# EAGLE design Octoprober (EAGLE 7.4.0)
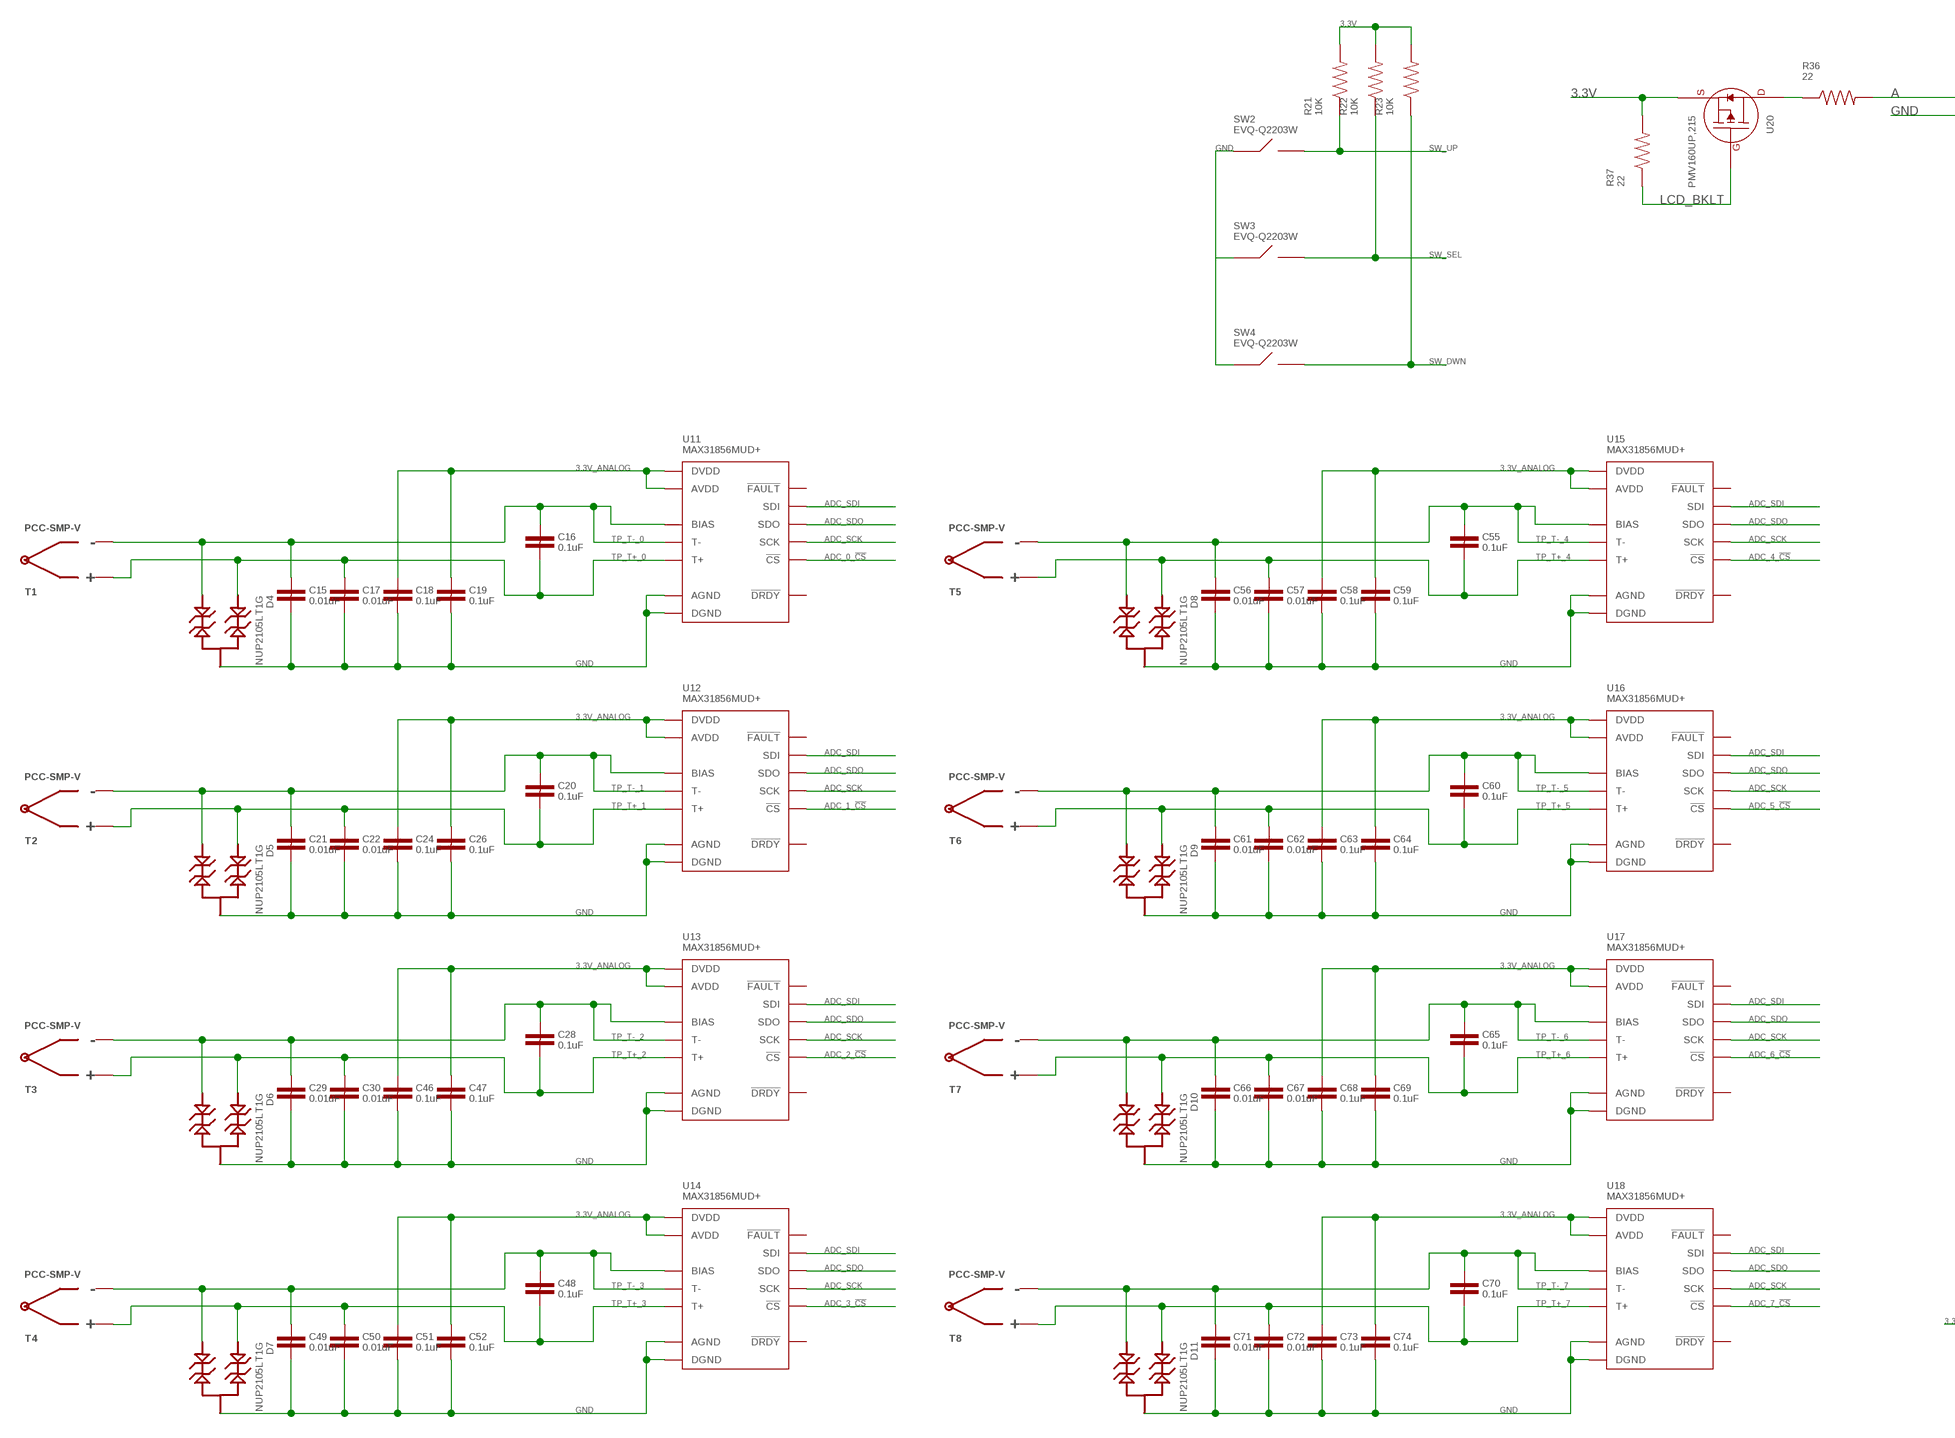
[diagram p0: schematic, sheet 1, part 1 of 3]
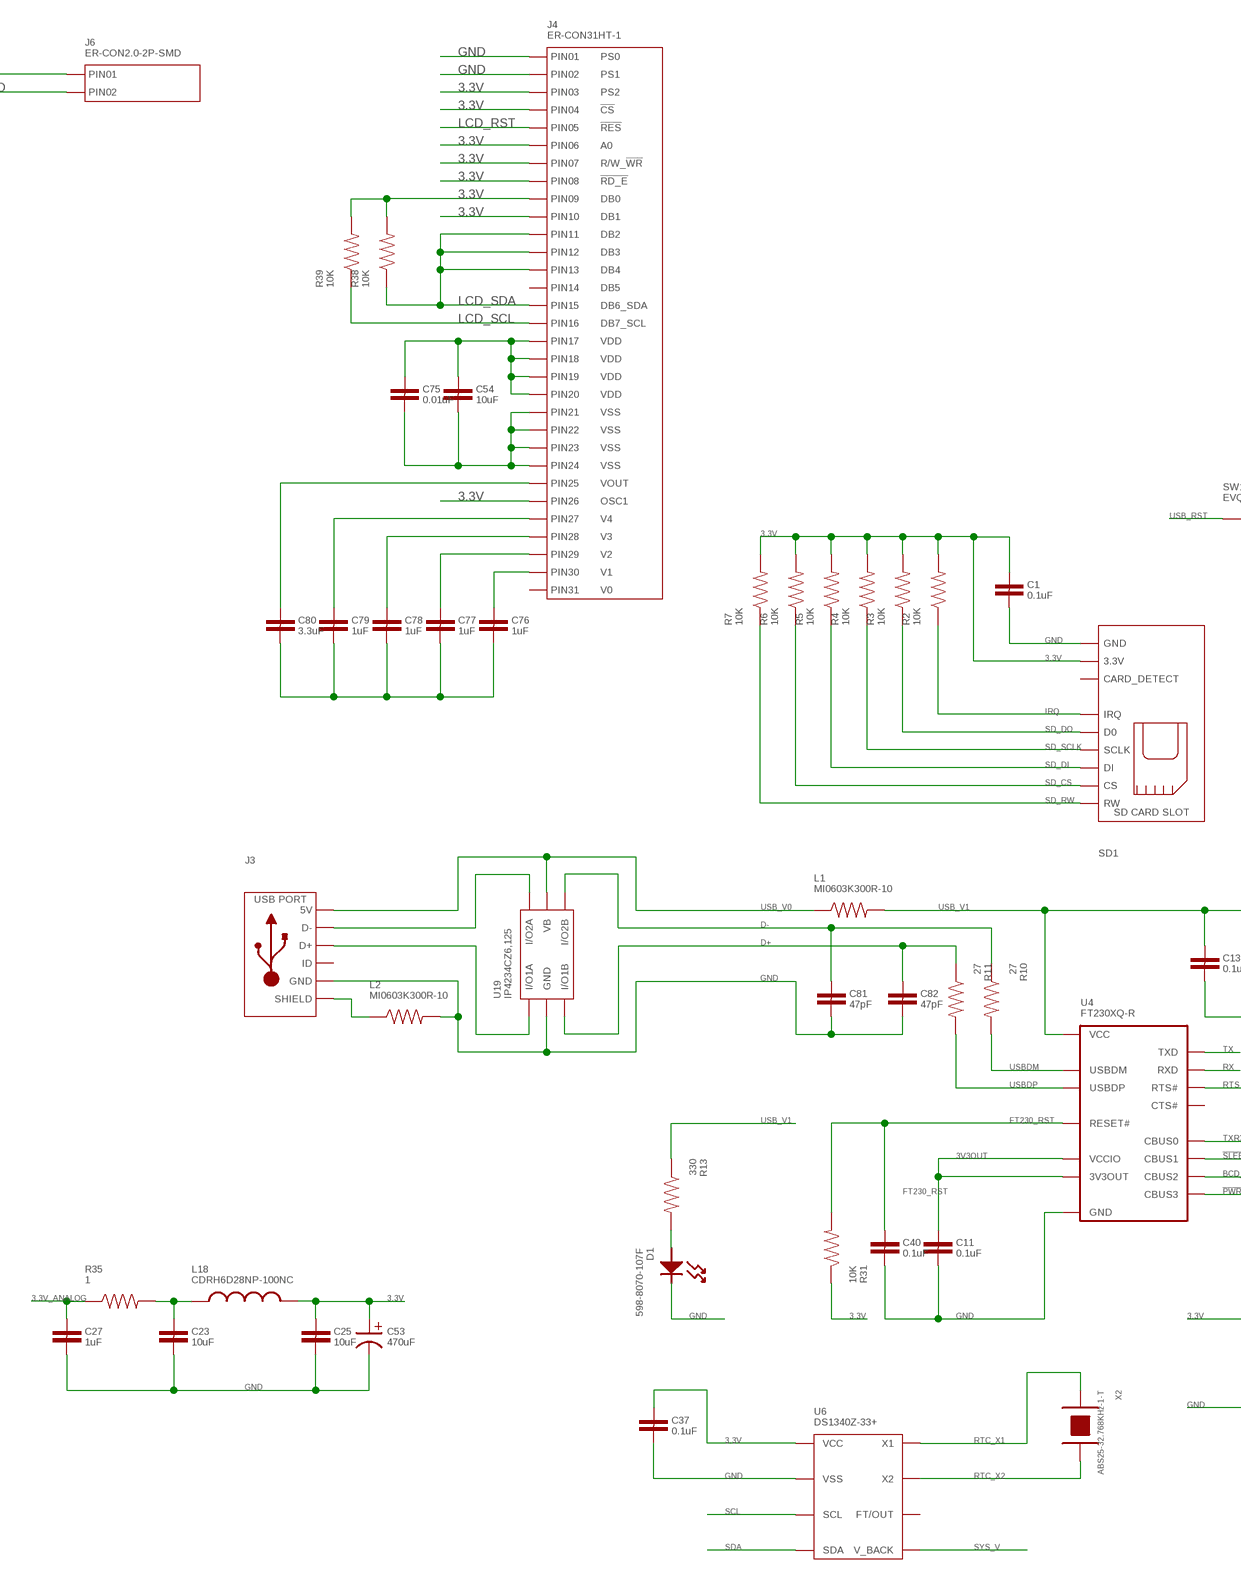
[diagram p1: schematic, sheet 1, part 2 of 3]
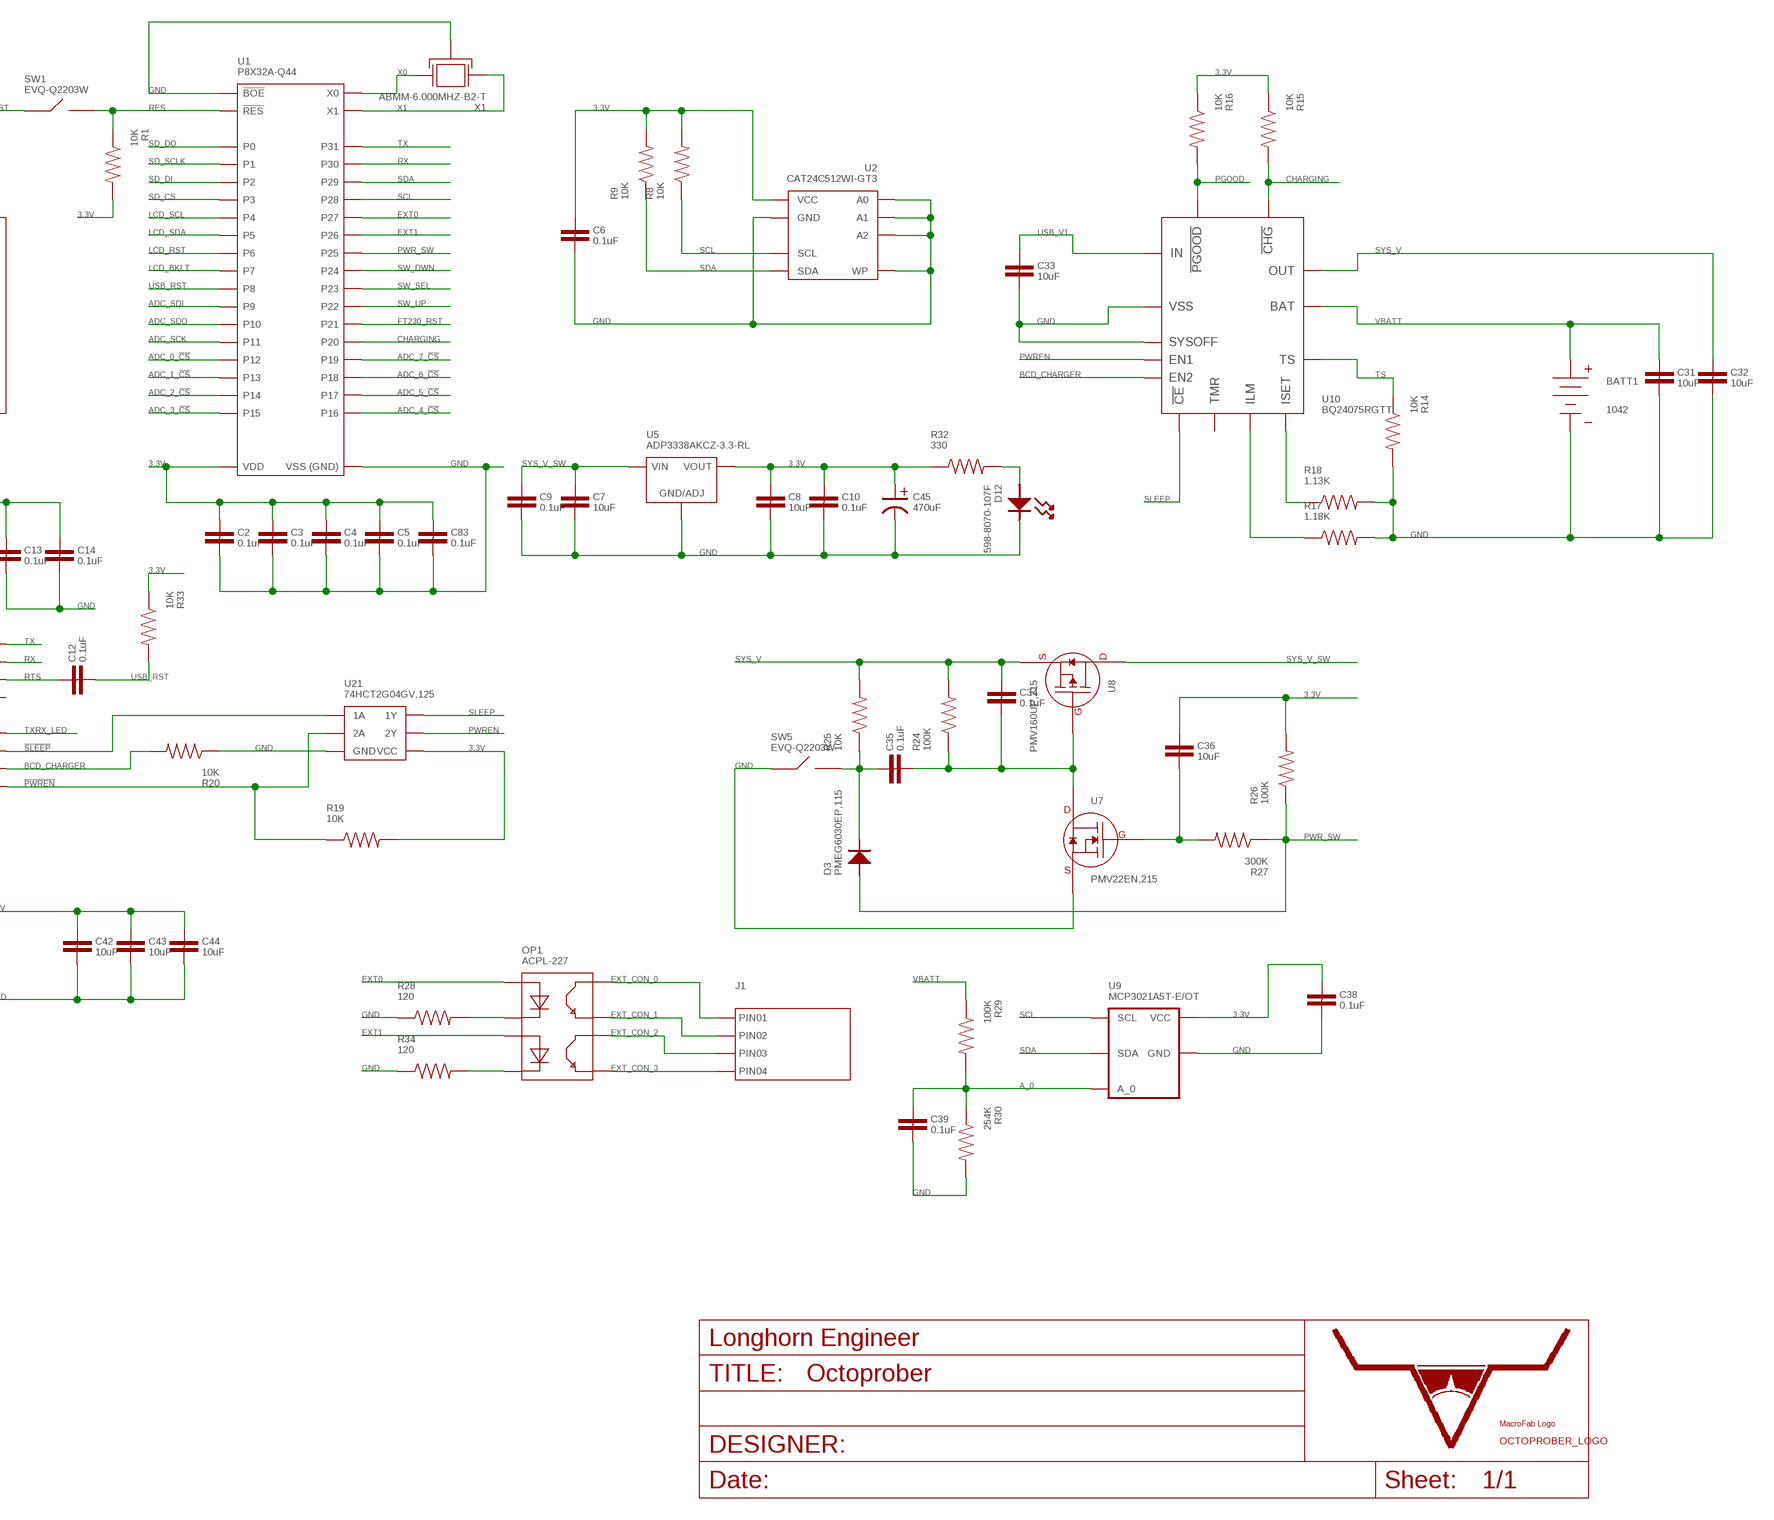
[diagram p2: schematic, sheet 1, part 3 of 3]

## Parts
BATT1  1042  BATTERY_KEYSTON_1042  [KEYSTONE_1042]
C1  0.1uF  CAPACITOR_NON_POLAR_0402  [0402]
C2  0.1uF  CAPACITOR_NON_POLAR_0603  [0603]
C3  0.1uF  CAPACITOR_NON_POLAR_0603  [0603]
C4  0.1uF  CAPACITOR_NON_POLAR_0603  [0603]
C5  0.1uF  CAPACITOR_NON_POLAR_0603  [0603]
C6  0.1uF  CAPACITOR_NON_POLAR_0603  [0603]
C7  10uF  CAPACITOR_NON_POLAR_1206  [1206]
C8  10uF  CAPACITOR_NON_POLAR_1206  [1206]
C9  0.1uF  CAPACITOR_NON_POLAR_0603  [0603]
C10  0.1uF  CAPACITOR_NON_POLAR_0603  [0603]
C11  0.1uF  CAPACITOR_NON_POLAR_0603  [0603]
C12  0.1uF  CAPACITOR_NON_POLAR_0603  [0603]
C13  0.1uF  CAPACITOR_NON_POLAR_0603  [0603]
C14  0.1uF  CAPACITOR_NON_POLAR_0603  [0603]
C15  0.01uF  CAPACITOR_NON_POLAR_0603  [0603]
C16  0.1uF  CAPACITOR_NON_POLAR_0603  [0603]
C17  0.01uF  CAPACITOR_NON_POLAR_0603  [0603]
C18  0.1uF  CAPACITOR_NON_POLAR_0603  [0603]
C19  0.1uF  CAPACITOR_NON_POLAR_0603  [0603]
C20  0.1uF  CAPACITOR_NON_POLAR_0603  [0603]
C21  0.01uF  CAPACITOR_NON_POLAR_0603  [0603]
C22  0.01uF  CAPACITOR_NON_POLAR_0603  [0603]
C23  10uF  CAPACITOR_NON_POLAR_1206  [1206]
C24  0.1uF  CAPACITOR_NON_POLAR_0603  [0603]
C25  10uF  CAPACITOR_NON_POLAR_1206  [1206]
C26  0.1uF  CAPACITOR_NON_POLAR_0603  [0603]
C27  1uF  CAPACITOR_NON_POLAR_0603  [0603]
C28  0.1uF  CAPACITOR_NON_POLAR_0603  [0603]
C29  0.01uF  CAPACITOR_NON_POLAR_0603  [0603]
C30  0.01uF  CAPACITOR_NON_POLAR_0603  [0603]
C31  10uF  CAPACITOR_NON_POLAR_1206  [1206]
C32  10uF  CAPACITOR_NON_POLAR_1206  [1206]
C33  10uF  CAPACITOR_NON_POLAR_1206  [1206]
C34  0.1uF  CAPACITOR_NON_POLAR_0603  [0603]
C35  0.1uF  CAPACITOR_NON_POLAR_0402  [0402]
C36  10uF  CAPACITOR_NON_POLAR_1206  [1206]
C37  0.1uF  CAPACITOR_NON_POLAR_0603  [0603]
C38  0.1uF  CAPACITOR_NON_POLAR_0603  [0603]
C39  0.1uF  CAPACITOR_NON_POLAR_0603  [0603]
C40  0.1uF  CAPACITOR_NON_POLAR_0603  [0603]
C42  10uF  CAPACITOR_NON_POLAR_1206  [1206]
C43  10uF  CAPACITOR_NON_POLAR_1206  [1206]
C44  10uF  CAPACITOR_NON_POLAR_1206  [1206]
C45  470uF  CAPACITOR_POLARIZED_CASE_D  [CASE_D]
C46  0.1uF  CAPACITOR_NON_POLAR_0603  [0603]
C47  0.1uF  CAPACITOR_NON_POLAR_0603  [0603]
C48  0.1uF  CAPACITOR_NON_POLAR_0603  [0603]
C49  0.01uF  CAPACITOR_NON_POLAR_0603  [0603]
C50  0.01uF  CAPACITOR_NON_POLAR_0603  [0603]
C51  0.1uF  CAPACITOR_NON_POLAR_0603  [0603]
C52  0.1uF  CAPACITOR_NON_POLAR_0603  [0603]
C53  470uF  CAPACITOR_POLARIZED_CASE_D  [CASE_D]
C54  10uF  CAPACITOR_NON_POLAR_1206  [1206]
C55  0.1uF  CAPACITOR_NON_POLAR_0603  [0603]
C56  0.01uF  CAPACITOR_NON_POLAR_0603  [0603]
C57  0.01uF  CAPACITOR_NON_POLAR_0603  [0603]
C58  0.1uF  CAPACITOR_NON_POLAR_0603  [0603]
C59  0.1uF  CAPACITOR_NON_POLAR_0603  [0603]
C60  0.1uF  CAPACITOR_NON_POLAR_0603  [0603]
C61  0.01uF  CAPACITOR_NON_POLAR_0603  [0603]
C62  0.01uF  CAPACITOR_NON_POLAR_0603  [0603]
C63  0.1uF  CAPACITOR_NON_POLAR_0603  [0603]
C64  0.1uF  CAPACITOR_NON_POLAR_0603  [0603]
C65  0.1uF  CAPACITOR_NON_POLAR_0603  [0603]
C66  0.01uF  CAPACITOR_NON_POLAR_0603  [0603]
C67  0.01uF  CAPACITOR_NON_POLAR_0603  [0603]
C68  0.1uF  CAPACITOR_NON_POLAR_0603  [0603]
C69  0.1uF  CAPACITOR_NON_POLAR_0603  [0603]
C70  0.1uF  CAPACITOR_NON_POLAR_0603  [0603]
C71  0.01uF  CAPACITOR_NON_POLAR_0603  [0603]
C72  0.01uF  CAPACITOR_NON_POLAR_0603  [0603]
C73  0.1uF  CAPACITOR_NON_POLAR_0603  [0603]
C74  0.1uF  CAPACITOR_NON_POLAR_0603  [0603]
C75  0.01uF  CAPACITOR_NON_POLAR_0603  [0603]
C76  1uF  CAPACITOR_NON_POLAR_0603  [0603]
C77  1uF  CAPACITOR_NON_POLAR_0603  [0603]
C78  1uF  CAPACITOR_NON_POLAR_0603  [0603]
C79  1uF  CAPACITOR_NON_POLAR_0603  [0603]
C80  3.3uF  CAPACITOR_NON_POLAR_0603  [0603]
C81  47pF  CAPACITOR_NON_POLAR_0603  [0603]
C82  47pF  CAPACITOR_NON_POLAR_0603  [0603]
C83  0.1uF  CAPACITOR_NON_POLAR_0603  [0603]
D1  598-8070-107F  LED_SINGLE_0805  [LED_0805]
D3  PMEG6030EP,115  DIODE_SOD-128  [SOD-128]
D4  NUP2105LT1G  TVS_DIODE_DUALSOT-23  [SOT-23]
D5  NUP2105LT1G  TVS_DIODE_DUALSOT-23  [SOT-23]
D6  NUP2105LT1G  TVS_DIODE_DUALSOT-23  [SOT-23]
D7  NUP2105LT1G  TVS_DIODE_DUALSOT-23  [SOT-23]
D8  NUP2105LT1G  TVS_DIODE_DUALSOT-23  [SOT-23]
D9  NUP2105LT1G  TVS_DIODE_DUALSOT-23  [SOT-23]
D10  NUP2105LT1G  TVS_DIODE_DUALSOT-23  [SOT-23]
D11  NUP2105LT1G  TVS_DIODE_DUALSOT-23  [SOT-23]
D12  598-8070-107F  LED_SINGLE_0805  [LED_0805]
J1  CON_01X04_2.54MM_PIN_HEADER  [2.54MM_01X04_PIN_HEADER]
J3  USB_MICRO_RIGHT  [MICROUSB-RIGHT]
J4  ER-CON31HT-1  CON_01X31_ER-CON31HT-1  [ER-CON31HT-1]
J6  ER-CON2.0-2P-SMD  CON_01X02_ER-CON2.0-2P-SMD  [ER-CON2.0-2P-SMD]
L1  MI0603K300R-10  RESISTOR_0603  [0603]
L2  MI0603K300R-10  RESISTOR_0603  [0603]
L18  CDRH6D28NP-100NC  INDUCTOR_CDRH6D28  [CDRH6D28]
OP1  ACPL-227  ACPL-227-500E  [ACPL-227_SO-8]
R1  10K  RESISTOR_0603  [0603]
R2  10K  RESISTOR_0402  [0402]
R3  10K  RESISTOR_0402  [0402]
R4  10K  RESISTOR_0402  [0402]
R5  10K  RESISTOR_0402  [0402]
R6  10K  RESISTOR_0402  [0402]
R7  10K  RESISTOR_0402  [0402]
R8  10K  RESISTOR_0603  [0603]
R9  10K  RESISTOR_0603  [0603]
R10  27  RESISTOR_0603  [0603]
R11  27  RESISTOR_0603  [0603]
R13  330  RESISTOR_0603  [0603]
R14  10K  RESISTOR_0603  [0603]
R15  10K  RESISTOR_0603  [0603]
R16  10K  RESISTOR_0603  [0603]
R17  1.18K  RESISTOR_0603  [0603]
R18  1.13K  RESISTOR_0603  [0603]
R19  10K  RESISTOR_0603  [0603]
R20  10K  RESISTOR_0603  [0603]
R21  10K  RESISTOR_0603  [0603]
R22  10K  RESISTOR_0603  [0603]
R23  10K  RESISTOR_0603  [0603]
R24  100K  RESISTOR_0603  [0603]
R25  10K  RESISTOR_0603  [0603]
R26  100K  RESISTOR_0603  [0603]
R27  300K  RESISTOR_0603  [0603]
R28  120  RESISTOR_0603  [0603]
R29  100K  RESISTOR_0603  [0603]
R30  254K  RESISTOR_0603  [0603]
R31  10K  RESISTOR_0603  [0603]
R32  330  RESISTOR_0603  [0603]
R33  10K  RESISTOR_0603  [0603]
R34  120  RESISTOR_0603  [0603]
R35  1  RESISTOR_0603  [0603]
R36  22  RESISTOR_0603  [0603]
R37  22  RESISTOR_0603  [0603]
R38  10K  RESISTOR_0603  [0603]
R39  10K  RESISTOR_0603  [0603]
SD1  SD_CARD_SLOT_MICRO_RIGHT  [MICROSDSLOT-RIGHT]
SW1  EVQ-Q2203W  SPST_EVQ-Q2203W  [EVQ-Q2203W]
SW2  EVQ-Q2203W  SPST_EVQ-Q2203W  [EVQ-Q2203W]
SW3  EVQ-Q2203W  SPST_EVQ-Q2203W  [EVQ-Q2203W]
SW4  EVQ-Q2203W  SPST_EVQ-Q2203W  [EVQ-Q2203W]
SW5  EVQ-Q2203W  SPST_EVQ-Q2203W  [EVQ-Q2203W]
T1  PCC-SMP-V  THERMOCOUPLE_CON_PCC-SMP-V  [PCC-SMP-V]
T2  PCC-SMP-V  THERMOCOUPLE_CON_PCC-SMP-V  [PCC-SMP-V]
T3  PCC-SMP-V  THERMOCOUPLE_CON_PCC-SMP-V  [PCC-SMP-V]
T4  PCC-SMP-V  THERMOCOUPLE_CON_PCC-SMP-V  [PCC-SMP-V]
T5  PCC-SMP-V  THERMOCOUPLE_CON_PCC-SMP-V  [PCC-SMP-V]
T6  PCC-SMP-V  THERMOCOUPLE_CON_PCC-SMP-V  [PCC-SMP-V]
T7  PCC-SMP-V  THERMOCOUPLE_CON_PCC-SMP-V  [PCC-SMP-V]
T8  PCC-SMP-V  THERMOCOUPLE_CON_PCC-SMP-V  [PCC-SMP-V]
U1  P8X32A-Q44  [LQFP44]
U2  CAT24C512WI-GT3  EEPROM_I2CSOIC-8  [SOIC-8]
U4  FT230XQ-R  FT230XQ  [FT230X_QFN-16]
U5  ADP3338AKCZ-3.3-RL  LINEAR_VOTLAGE_REGULATORS_ADP3338  [ADP3338_SOT-223-3]
U6  DS1340Z-33+  [DS1340Z_SOIC-8]
U7  PMV22EN,215  MOSFET_N-CHANNEL_SINGLE_SOT-23  [SOT-23-3]
U8  PMV160UP,215  MOSFET_P-CHANNEL_SINGLE_SOT-23  [SOT-23-3]
U9  MCP3021A5T-E/OT  MCP3021A0T-E/OT  [MCP3021_SOT-23-5]
U10  BQ24075RGTT  BQ2407(5/9)  [BQ2407X_VQFN-16]
U11  MAX31856MUD+  [MAX31856_TTSOP-14]
U12  MAX31856MUD+  [MAX31856_TTSOP-14]
U13  MAX31856MUD+  [MAX31856_TTSOP-14]
U14  MAX31856MUD+  [MAX31856_TTSOP-14]
U15  MAX31856MUD+  [MAX31856_TTSOP-14]
U16  MAX31856MUD+  [MAX31856_TTSOP-14]
U17  MAX31856MUD+  [MAX31856_TTSOP-14]
U18  MAX31856MUD+  [MAX31856_TTSOP-14]
U19  IP4234CZ6,125  IP4234CZ6  [IP4234CZ6_SOT-457-6]
U20  PMV160UP,215  MOSFET_P-CHANNEL_SINGLE_SOT-23  [SOT-23-3]
U21  74HCT2G04GV,125  [74HCT2G04_TTSOP-6]
U$1  LHE_FRAME  [LHE_FRAME]
U$2  OCTOPROBER_LOGONORMAL  [OCTOPROBER_LOGO]
U$7  MF_LOGOLOGO_MEDIUM  [MF_LOGO_MEDIUM]
X1  ABMM-6.000MHZ-B2-T  XTL_7MMX5MM  [7MMX5MM]
X2  ABS25-32.768KHz-1-T  CRYSTAL_8MM_X_3.8MM  [8MM_X_3.8MM]

## Nets
3.3V: C1.1 C2.1 C3.1 C4.1 C5.1 C6.1 C8.1 C10.1 C25.1 C36.1 C37.1 C38.1 C42.1 C43.1 C44.1 C45.P(POS) C53.P(POS) C83.1 J4.P$3(PIN3) J4.P$4(PIN4) J4.P$6(PIN6) J4.P$7(PIN7) J4.P$8(PIN8) J4.P$9(PIN9) J4.P$10(PIN10) J4.P$26(PIN26) L18.P$2 R1.2 R2.2 R3.2 R4.2 R5.2 R6.2 R7.2 R8.2 R9.2 R15.1 R16.1 R19.2 R21.2 R22.2 R23.2 R26.2 R31.1 R32.1 R33.1 R37.2 R38.2 R39.2 SD1.PIN4(3.3V) U1.8(VDD) U1.18(VDD) U1.30(VDD) U1.40(VDD) U2.8(VCC) U5.2(OUT) U5.PAD(OUT) U6.8(VCC) U9.1(VCC) U20.2(SOURCE) U21.5(VCC)
3.3V_ANALOG: C18.1 C19.1 C24.1 C26.1 C27.1 C46.1 C47.1 C51.1 C52.1 C58.1 C59.1 C63.1 C64.1 C68.1 C69.1 C73.1 C74.1 R35.1 U11.P$5(AVDD) U11.P$8(DVDD) U12.P$5(AVDD) U12.P$8(DVDD) U13.P$5(AVDD) U13.P$8(DVDD) U14.P$5(AVDD) U14.P$8(DVDD) U15.P$5(AVDD) U15.P$8(DVDD) U16.P$5(AVDD) U16.P$8(DVDD) U17.P$5(AVDD) U17.P$8(DVDD) U18.P$5(AVDD) U18.P$8(DVDD)
3V3OUT: C11.1 U4.1(VCCIO) U4.8(3V3OUT)
!PWREN: R19.1 U4.14(CBUS3) U21.3(2A)
!SLEEP: U4.11(CBUS1) U21.1(1A)
A: J6.P$1(PIN1) R36.2
A_0: C39.1 R29.2 R30.1 U9.3(A_0)
ADC_0_!CS: U1.13(P12) U11.P$9(!CS)
ADC_1_!CS: U1.14(P13) U12.P$9(!CS)
ADC_2_!CS: U1.15(P14) U13.P$9(!CS)
ADC_3_!CS: U1.16(P15) U14.P$9(!CS)
ADC_4_!CS: U1.19(P16) U15.P$9(!CS)
ADC_5_!CS: U1.20(P17) U16.P$9(!CS)
ADC_6_!CS: U1.21(P18) U17.P$9(!CS)
ADC_7_!CS: U1.22(P19) U18.P$9(!CS)
ADC_SCK: U1.12(P11) U11.P$10(SCK) U12.P$10(SCK) U13.P$10(SCK) U14.P$10(SCK) U15.P$10(SCK) U16.P$10(SCK) U17.P$10(SCK) U18.P$10(SCK)
ADC_SDI: U1.10(P9) U11.P$12(SDI) U12.P$12(SDI) U13.P$12(SDI) U14.P$12(SDI) U15.P$12(SDI) U16.P$12(SDI) U17.P$12(SDI) U18.P$12(SDI)
ADC_SDO: U1.11(P10) U11.P$11(SDO) U12.P$11(SDO) U13.P$11(SDO) U14.P$11(SDO) U15.P$11(SDO) U16.P$11(SDO) U17.P$11(SDO) U18.P$11(SDO)
BCD_CHARGER: R20.2 U4.5(CBUS2) U10.5(EN2)
CHARGING: R15.2 U1.23(P20) U10.9(!CHG)
D+: C82.1 R11.1 U19.3(I/O1B)
D-: C81.1 R10.1 U19.4(I/O2B)
EXT0: OP1.1 U1.34(P27)
EXT1: OP1.3 U1.33(P26)
EXT_CON_0: J1.1 OP1.8
EXT_CON_1: J1.2 OP1.7
EXT_CON_2: J1.3 OP1.6
EXT_CON_3: J1.4 OP1.5
FT230_RST: C40.1 R31.2 U1.24(P21) U4.9(RESET#)
GND: BATT1.N(-) C1.2 C2.2 C3.2 C4.2 C5.2 C6.2 C7.2 C8.2 C9.2 C10.2 C11.2 C13.2 C14.2 C15.2 C17.2 C18.2 C19.2 C21.2 C22.2 C23.2 C24.2 C25.2 C26.2 C27.2 C29.2 C30.2 C31.2 C32.2 C33.2 C37.2 C38.2 C39.2 C40.2 C42.2 C43.2 C44.2 C45.N(NEG) C46.2 C47.2 C49.2 C50.2 C51.2 C52.2 C53.N(NEG) C56.2 C57.2 C58.2 C59.2 C61.2 C62.2 C63.2 C64.2 C66.2 C67.2 C68.2 C69.2 C71.2 C72.2 C73.2 C74.2 C81.2 C82.2 C83.2 D1.CATHODE D4.3 D5.3 D6.3 D7.3 D8.3 D9.3 D10.3 D11.3 D12.CATHODE J3.5(GND) J4.P$1(PIN1) J4.P$2(PIN2) J6.P$2(PIN2) L2.2 R14.2 R17.2 R18.2 R20.1 R28.1 R30.2 R34.1 SD1.G0(GND) SD1.G1(GND) SD1.PIN6(GND) SW2.1(A) SW2.2(A) SW3.1(A) SW3.2(A) SW4.1(A) SW4.2(A) SW5.1(A) SW5.2(A) U1.5(VSS) U1.6(BOE') U1.17(VSS) U1.27(VSS) U1.39(VSS) U2.1(A0) U2.2(A1) U2.3(A2) U2.4(GND) U2.7(WP) U4.3(GND) U4.13(GND) U4.PAD(GND) U5.1(GND) U6.4(VSS) U7.2(SOURCE) U9.2(GND) U10.8(VSS) U10.15(SYSOFF) U10.PAD0(VSS) U10.PAD1(VSS) U11.P$1(AGND) U11.P$14(DGND) U12.P$1(AGND) U12.P$14(DGND) U13.P$1(AGND) U13.P$14(DGND) U14.P$1(AGND) U14.P$14(DGND) U15.P$1(AGND) U15.P$14(DGND) U16.P$1(AGND) U16.P$14(DGND) U17.P$1(AGND) U17.P$14(DGND) U18.P$1(AGND) U18.P$14(DGND) U19.2(GND) U21.2(GND) X1.P$2(GND) X1.P$4(GND)
ILM: R17.1 U10.12(ILM)
IRQ: R2.1 SD1.PIN8(IRQ)
ISET: R18.1 U10.16(ISET)
LCD_BKLT: R37.1 U1.4(P7) U20.1(GATE)
LCD_RST: J4.P$5(PIN5) U1.3(P6)
LCD_SCL: J4.P$16(PIN16) R39.1 U1.1(P4)
LCD_SDA: J4.P$11(PIN11) J4.P$12(PIN12) J4.P$13(PIN13) J4.P$15(PIN15) R38.1 U1.2(P5)
N$2: C54.1 C75.1 J4.P$17(PIN17) J4.P$18(PIN18) J4.P$19(PIN19) J4.P$20(PIN20)
N$3: D1.ANODE R13.2
N$4: C35.1 D3.CATHODE R25.1 SW5.3(B) SW5.4(B)
N$5: C36.2 R27.2 U7.1(GATE)
N$6: OP1.2 R28.2
N$7: R36.1 U20.3(DRAIN)
N$8: C54.2 C75.2 J4.P$21(PIN21) J4.P$22(PIN22) J4.P$23(PIN23) J4.P$24(PIN24)
N$9: C80.1 J4.P$25(PIN25)
N$10: C79.1 J4.P$27(PIN27)
N$11: C78.1 J4.P$28(PIN28)
N$12: C77.1 J4.P$29(PIN29)
N$13: C76.1 J4.P$30(PIN30)
N$14: C76.2 C77.2 C78.2 C79.2 C80.2
N$22: D12.ANODE R32.2
N$23: J3.2(D-) U19.6(I/O2A)
N$24: OP1.4 R34.2
N$25: C23.1 L18.P$1 R35.2
N$26: J3.3(D+) U19.1(I/O1A)
N$27: J3.S1(SLD) J3.S2(SLD) J3.S3(SLD) J3.S4(SLD) J3.S5(SLD) J3.S6(SLD) L2.1
PGOOD: R16.2 U10.7(!PGOOD)
PWR_SW: D3.ANODE R26.1 R27.1 U1.32(P25)
PWREN: U10.6(EN1) U21.4(2Y)
RES: R1.1 SW1.3(B) SW1.4(B) U1.7(RES')
RTC_X1: U6.1(X1) X2.1
RTC_X2: U6.2(X2) X2.4
RTS: C12.1 U4.16(RTS#)
RX: U1.37(P30) U4.2(RXD)
S_P_G: C34.2 C35.2 R24.1 U7.3(DRAIN) U8.1(GATE)
SCL: R8.1 U1.35(P28) U2.6(SCL) U6.6(SCL) U9.5(SCL)
SD_CS: R6.1 SD1.PIN2(CS) U1.44(P3)
SD_DI: R5.1 SD1.PIN3(DI) U1.43(P2)
SD_DO: R3.1 SD1.PIN7(D0) U1.41(P0)
SD_RW: R7.1 SD1.PIN1(RW)
SD_SCLK: R4.1 SD1.PIN5(SCLK) U1.42(P1)
SDA: R9.1 U1.36(P29) U2.5(SDA) U6.5(SDA) U9.4(SDA)
SLEEP: U10.4(!CE) U21.6(1Y)
SW_DWN: R23.1 SW4.3(B) SW4.4(B) U1.31(P24)
SW_SEL: R22.1 SW3.3(B) SW3.4(B) U1.26(P23)
SW_UP: R21.1 SW2.3(B) SW2.4(B) U1.25(P22)
SYS_V: C32.1 C34.1 R24.2 R25.2 U6.3(V_BACK) U8.2(SOURCE) U10.10(OUT) U10.11(OUT)
SYS_V_SW: C7.1 C9.1 U5.3(IN) U8.3(DRAIN)
TP_T+_0: C16.2 C17.1 D4.1 T1.POS U11.P$4(T+)
TP_T+_1: C20.2 C22.1 D5.1 T2.POS U12.P$4(T+)
TP_T+_2: C28.2 C30.1 D6.1 T3.POS U13.P$4(T+)
TP_T+_3: C48.2 C50.1 D7.1 T4.POS U14.P$4(T+)
TP_T+_4: C55.2 C57.1 D8.1 T5.POS U15.P$4(T+)
TP_T+_5: C60.2 C62.1 D9.1 T6.POS U16.P$4(T+)
TP_T+_6: C65.2 C67.1 D10.1 T7.POS U17.P$4(T+)
TP_T+_7: C70.2 C72.1 D11.1 T8.POS U18.P$4(T+)
TP_T-_0: C15.1 C16.1 D4.2 T1.NEG U11.P$2(BIAS) U11.P$3(T-)
TP_T-_1: C20.1 C21.1 D5.2 T2.NEG U12.P$2(BIAS) U12.P$3(T-)
TP_T-_2: C28.1 C29.1 D6.2 T3.NEG U13.P$2(BIAS) U13.P$3(T-)
TP_T-_3: C48.1 C49.1 D7.2 T4.NEG U14.P$2(BIAS) U14.P$3(T-)
TP_T-_4: C55.1 C56.1 D8.2 T5.NEG U15.P$2(BIAS) U15.P$3(T-)
TP_T-_5: C60.1 C61.1 D9.2 T6.NEG U16.P$2(BIAS) U16.P$3(T-)
TP_T-_6: C65.1 C66.1 D10.2 T7.NEG U17.P$2(BIAS) U17.P$3(T-)
TP_T-_7: C70.1 C71.1 D11.2 T8.NEG U18.P$2(BIAS) U18.P$3(T-)
TS: R14.1 U10.1(TS)
TX: U1.38(P31) U4.15(TXD)
TXRX_LED: U4.12(CBUS0)
USB_RST: C12.2 R33.2 SW1.1(A) SW1.2(A) U1.9(P8)
USB_V0: J3.1(5V) L1.1 U19.5(VB)
USB_V1: C13.1 C14.1 C33.1 L1.2 R13.1 U4.10(VCC) U10.13(IN)
USBDM: R10.2 U4.7(USBDM)
USBDP: R11.2 U4.6(USBDP)
VBATT: BATT1.P(+) C31.1 R29.1 U10.2(BAT) U10.3(BAT)
X0: U1.29(X0) X1.P$3(X1)
X1: U1.28(X1) X1.P$1(X0)
Unconnected: J3.4(ID) J4.P$14(PIN14) J4.P$31(PIN31) SD1.PIN9(CRD_DTCT) SD1.PIN10(CRD_DTCT) U4.4(CTS#) U6.7(FT/OUT) U10.14(TMR) U11.P$7(!DRDY) U11.P$13(!FAULT) U12.P$7(!DRDY) U12.P$13(!FAULT) U13.P$7(!DRDY) U13.P$13(!FAULT) U14.P$7(!DRDY) U14.P$13(!FAULT) U15.P$7(!DRDY) U15.P$13(!FAULT) U16.P$7(!DRDY) U16.P$13(!FAULT) U17.P$7(!DRDY) U17.P$13(!FAULT) U18.P$7(!DRDY) U18.P$13(!FAULT)

## Library data of the parts
BATT1 = PP_Connectors:BATTERY
C1-C40 C42-C44 C46-C52 C54-C83 = PP_Passives:CAPACITOR_NON_POLAR: Capacitor Non Polarized
C45 C53 = PP_Passives:CAPACITOR_POLARIZED: Polarized capacitors
D1 D12 = PP_LED:LED_SINGLE
D3 = PP_Passives:DIODE: Diode - Single
D4-D11 = PP_Passives:TVS_DIODE_DUAL
J1 = PP_Connectors:CON_01X04: 4 Pin Connectors
J3 = MF_Connectors:USB: Library: MF_Connectors Description: 5 Pin USB Connectors. SLD is the shield connection. Usually tied to ground through a small ferrite bead.
J4 = PP_Connectors:CON_01X31; LABEL01: PS0; LABEL02: PS1; LABEL03: PS2; LABEL04: !CS; LABEL05: !RES; LABEL06: A0; LABEL07: R/W_!WR; LABEL08: !RD_E; LABEL09: DB0; LABEL10: DB1; LABEL11: DB2; LABEL12: DB3; LABEL13: DB4; LABEL14: DB5; LABEL15: DB6_SDA; LABEL16: DB7_SCL; LABEL17: VDD; LABEL18: VDD; LABEL19: VDD; LABEL20: VDD; LABEL21: VSS; LABEL22: VSS; LABEL23: VSS; LABEL24: VSS; LABEL25: VOUT; LABEL26: OSC1; LABEL27: V4; LABEL28: V3; LABEL29: V2; LABEL30: V1; LABEL31: V0
J6 = PP_Connectors:CON_01X02
L1 L2 R1-R11 R13-R39 = PP_Passives:RESISTOR: Resistors
L18 = PP_Passives:INDUCTOR: Inductors
OP1 = PP_DigitalIC:ACPL-227: Manufacturer Part #: ACPL-227 Manufacturer: Avago Technologies Description: Transistor Output Optocouplers DC Phototx Coupler
SD1 = MF_Connectors:SD_CARD_SLOT: Library: MF_Connectors Description: SD Card Connector
SW1-SW5 = PP_Electromechanical:SPST: SPST Switches
T1-T8 = PP_Connectors:THERMOCOUPLE_CON
U1 = MF_IC_Digital:P8X32A: Manufacturer Part #: P8X32A Manufacturer: Parallax Description: 32-bit Microcontrollers - MCU LQFP pkg Propeller Chip
U2 = PP_DigitalIC:EEPROM_I2C
U4 = PP_DigitalIC:FT230X: Manufacturer Part #: FT230X Manufacturer: FTDI Description: USB Interface IC USB to Basic Serial UART IC
U5 = PP_PowerIC:LINEAR_VOTLAGE_REGULATORS
U6 = PP_DigitalIC:DS1340Z: Manufacturer Part #: DS1340Z Manufacturer: Maxim Integrated Description: Real Time Clock I2C RTC w/Trickle Charger
U7 = PP_DiscreteSemi:MOSFET_N-CHANNEL_SINGLE: Mosfet - N-Channel - Single
U8 U20 = PP_DiscreteSemi:MOSFET_P-CHANNEL_SINGLE
U9 = PP_DigitalIC:MCP3021: Manufacturer Part #: MCP3021 Manufacturer: Microchip Technology Description: Analog to Digital Converters - ADC 10-bit ADC I2C Single Channel
U10 = PP_PowerIC:BQ2407(5/9): Manufacturer Part #: BQ24075 / BQ24079 Manufacturer: Texas Instruments Description: Battery Management Li-Ion Batt Chrgr & Pwr-Path Mgmt IC
U11-U18 = PP_AnalogIC:MAX31856: Manufacturer Part #: MAX31856 Manufacturer: Maxim Integrated Description: Sensor Interface Precision Thermocouple to Digital Converter with Linearization
U19 = PP_Passives:IP4234CZ6: Mouser Part #: 771-IP4234CZ6125 Manufacturer Part #: IP4234CZ6,125 Manufacturer: NXP Semiconductors Description: ESD Suppressors Single USB 2.0 ESD Protection 6-Pin http://www.mouser.com/ProductDetail/NXP-Semiconductors/IP4234CZ6125/?qs=sGAEpiMZZMvxHShE6Whpu7QUdHOfUl1T0xbl582qhFk%3d
U21 = PP_DigitalIC:74HCT2G04: Manufacturer Part #: 74HCT2G04 Manufacturer: NXP Semiconductors Description: Inverters 5V 2-INPUT SINGLE
U$1 = PP_Aesthetics:LHE_FRAME; DNAME: Parker Dillmann; REVNUM: REV 3
U$2 = PP_Aesthetics:OCTOPROBER_LOGO
U$7 = PP_Aesthetics:MF_LOGO
X1 = MF_Frequency_Control:XTL: Library: MF_Frequency_Control Description: Device for Cyrstal Oscillators. Manufacture part number (MFG#) can be added via Attributes.
X2 = PP_FreqCtrl:CRYSTAL

## Board
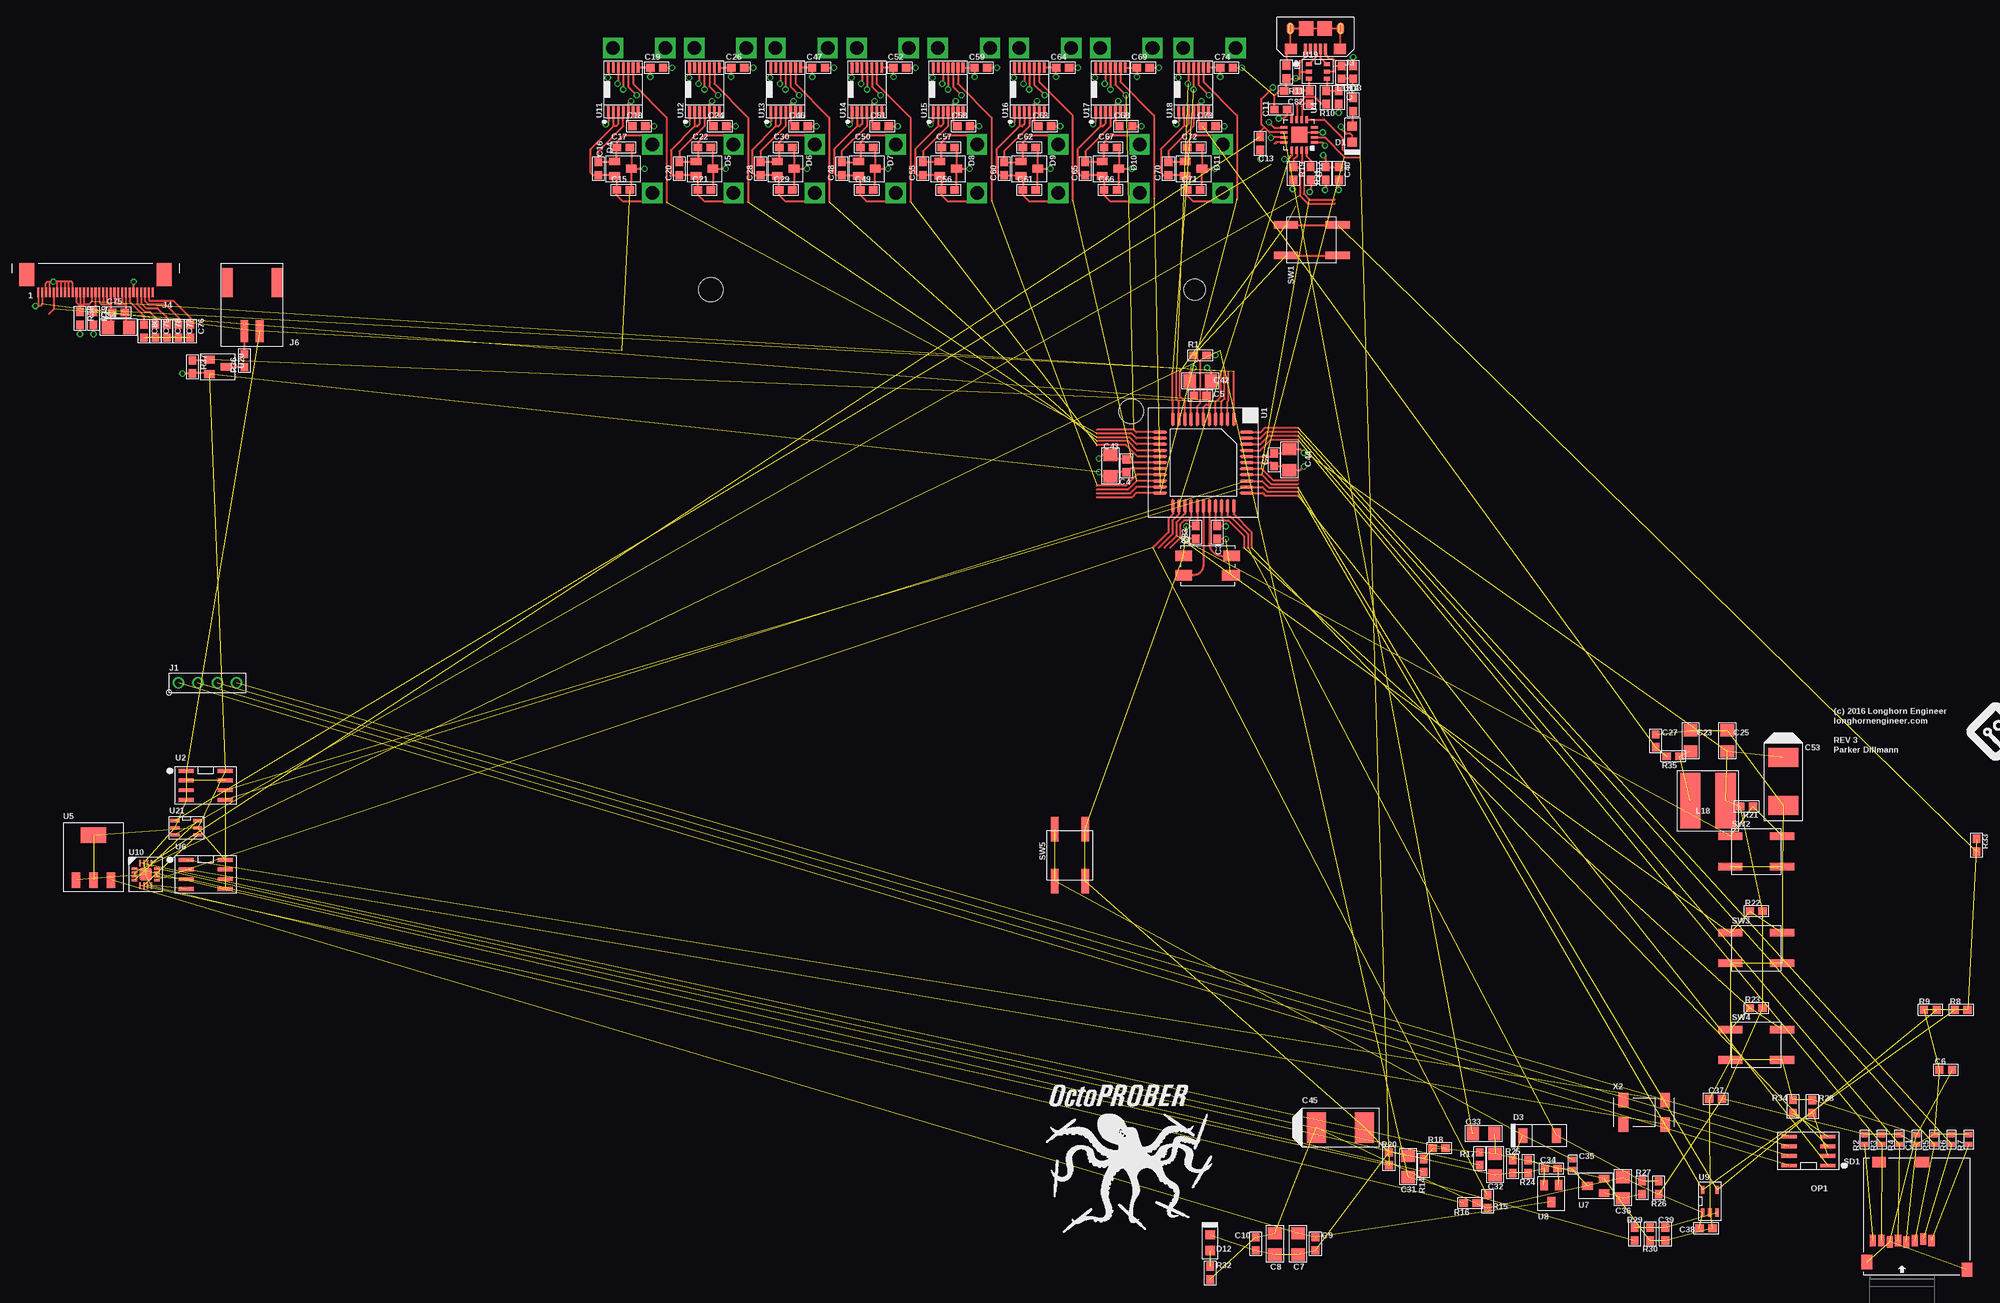
[diagram p3: board, top side]
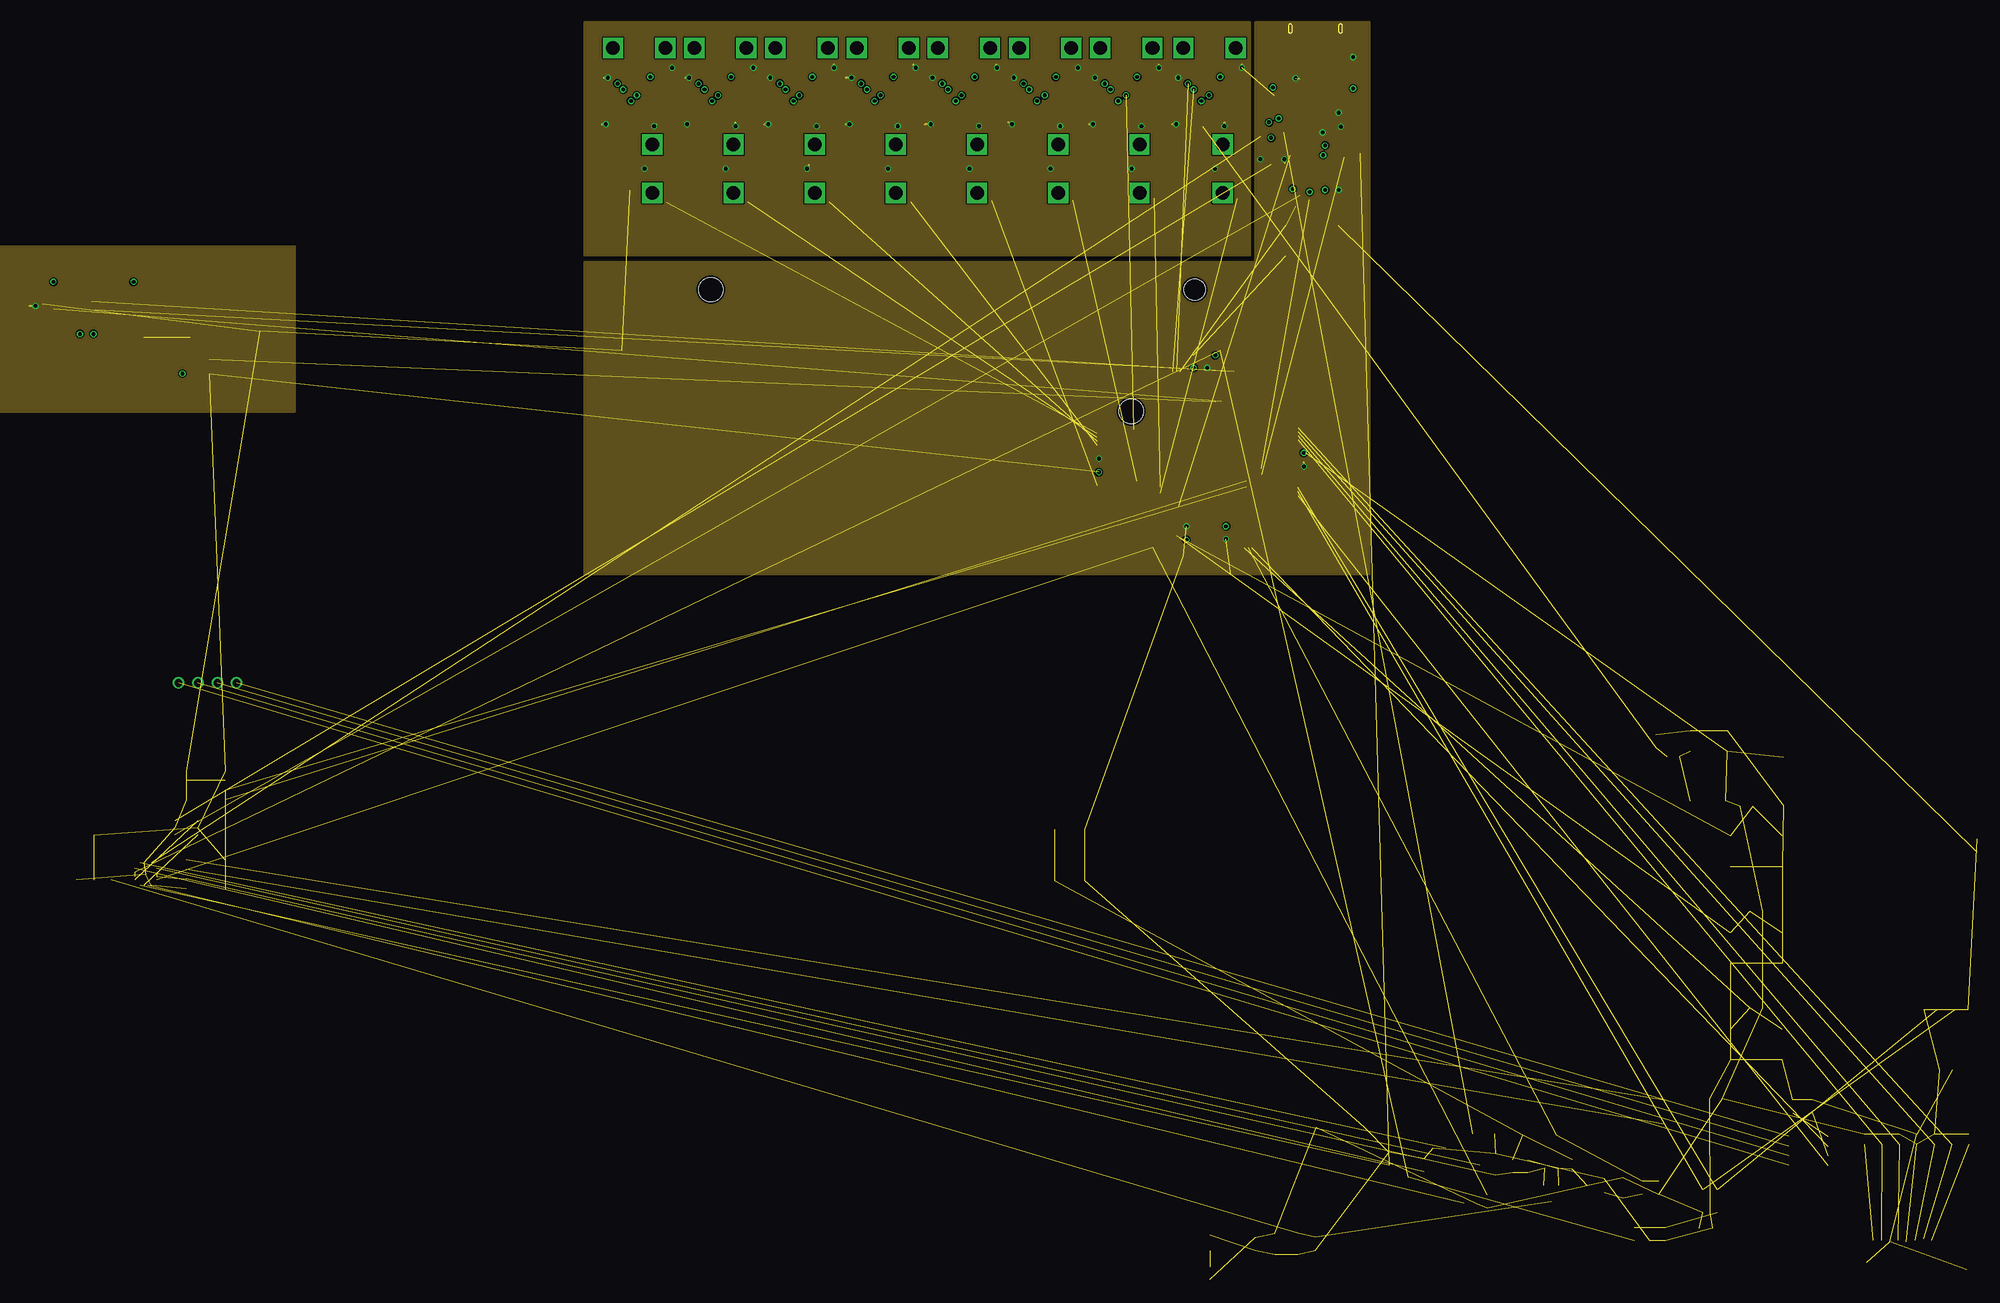
[diagram p4: board, inner layer GND]
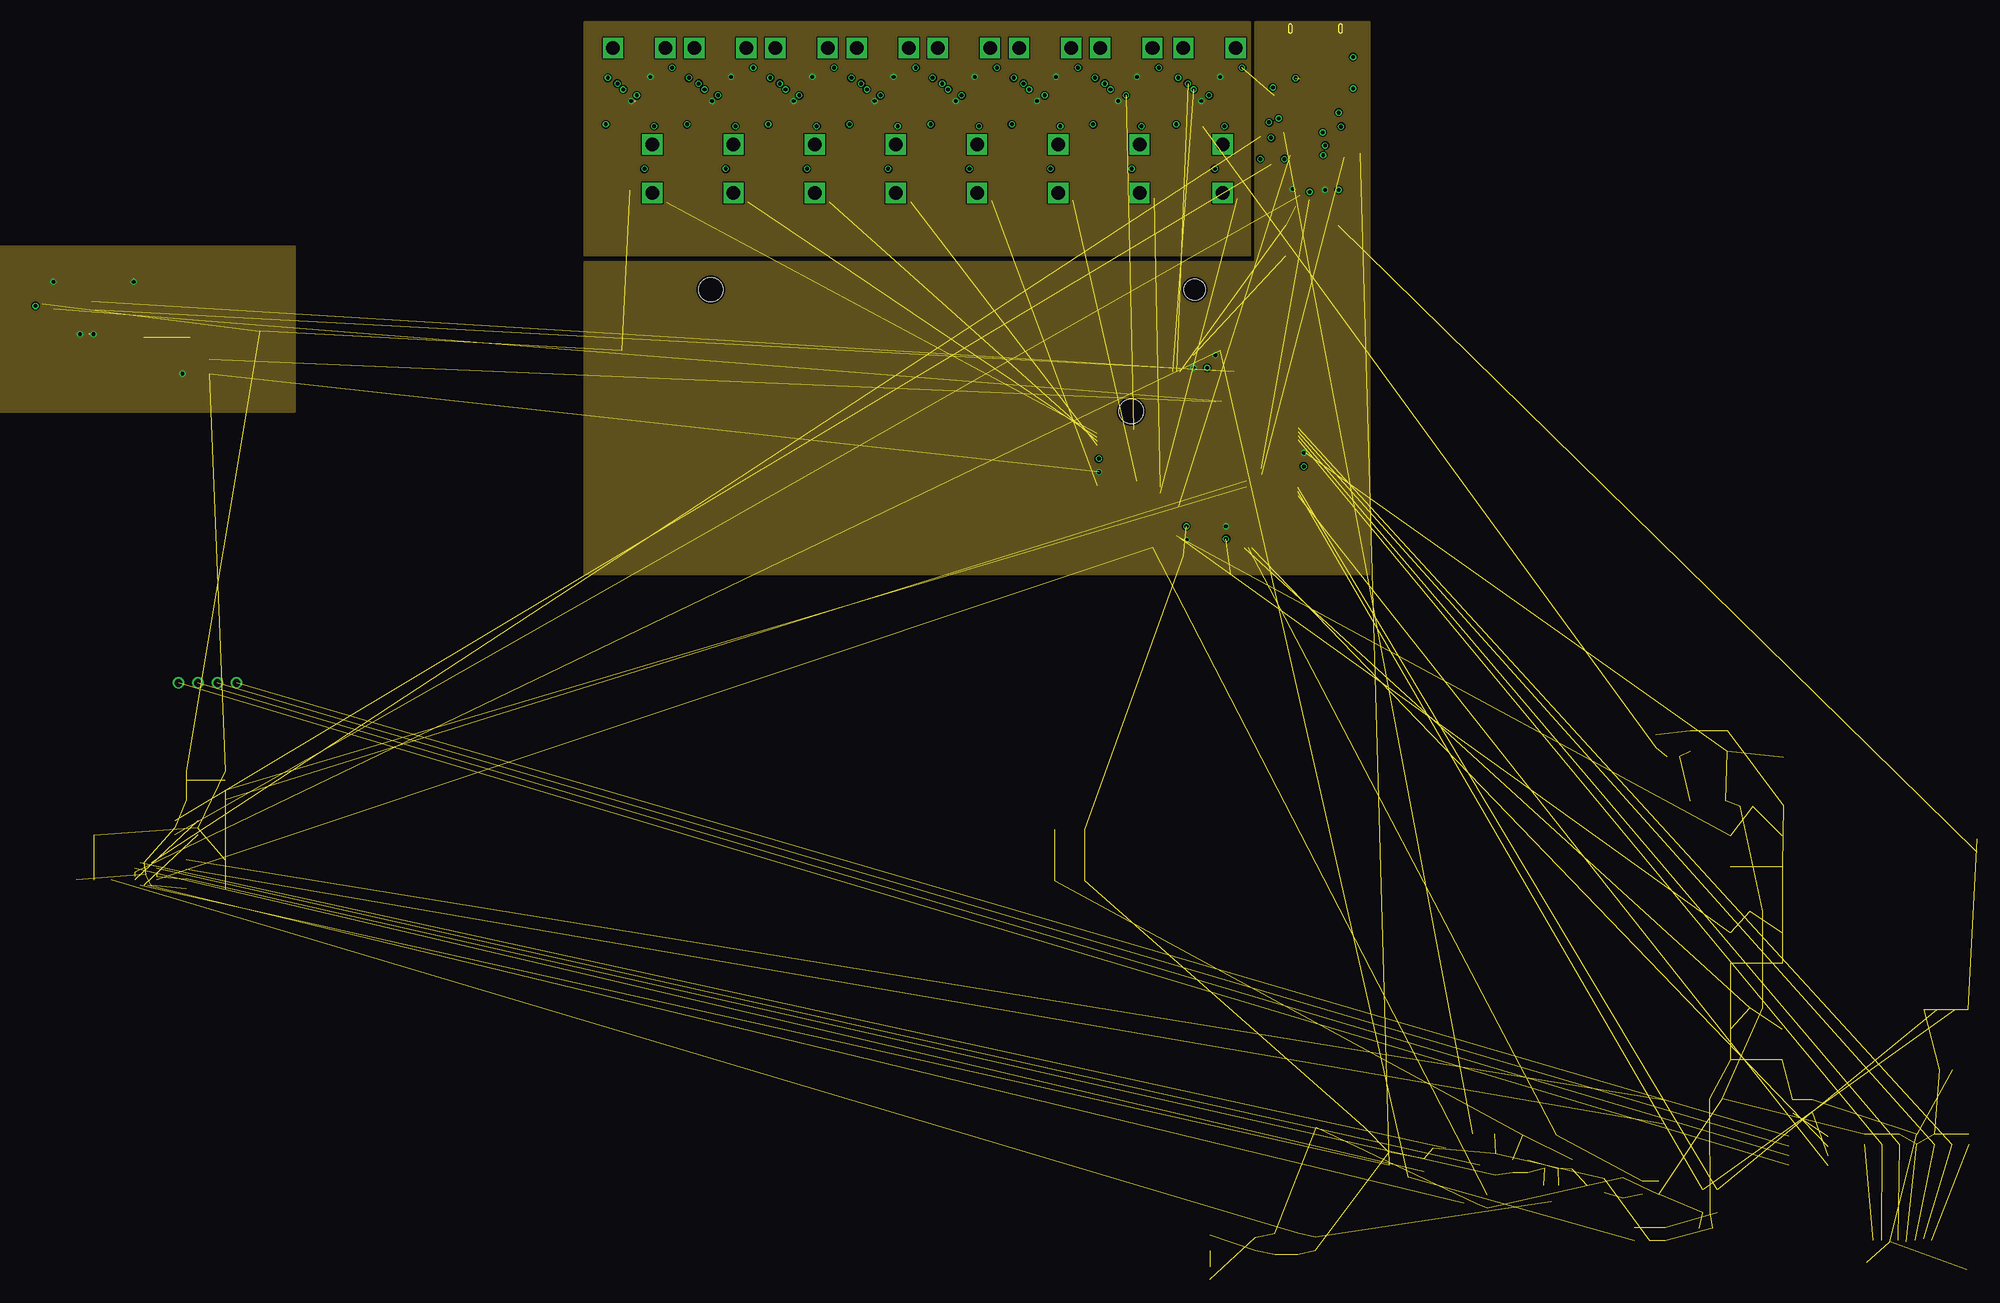
[diagram p5: board, inner layer Route15]
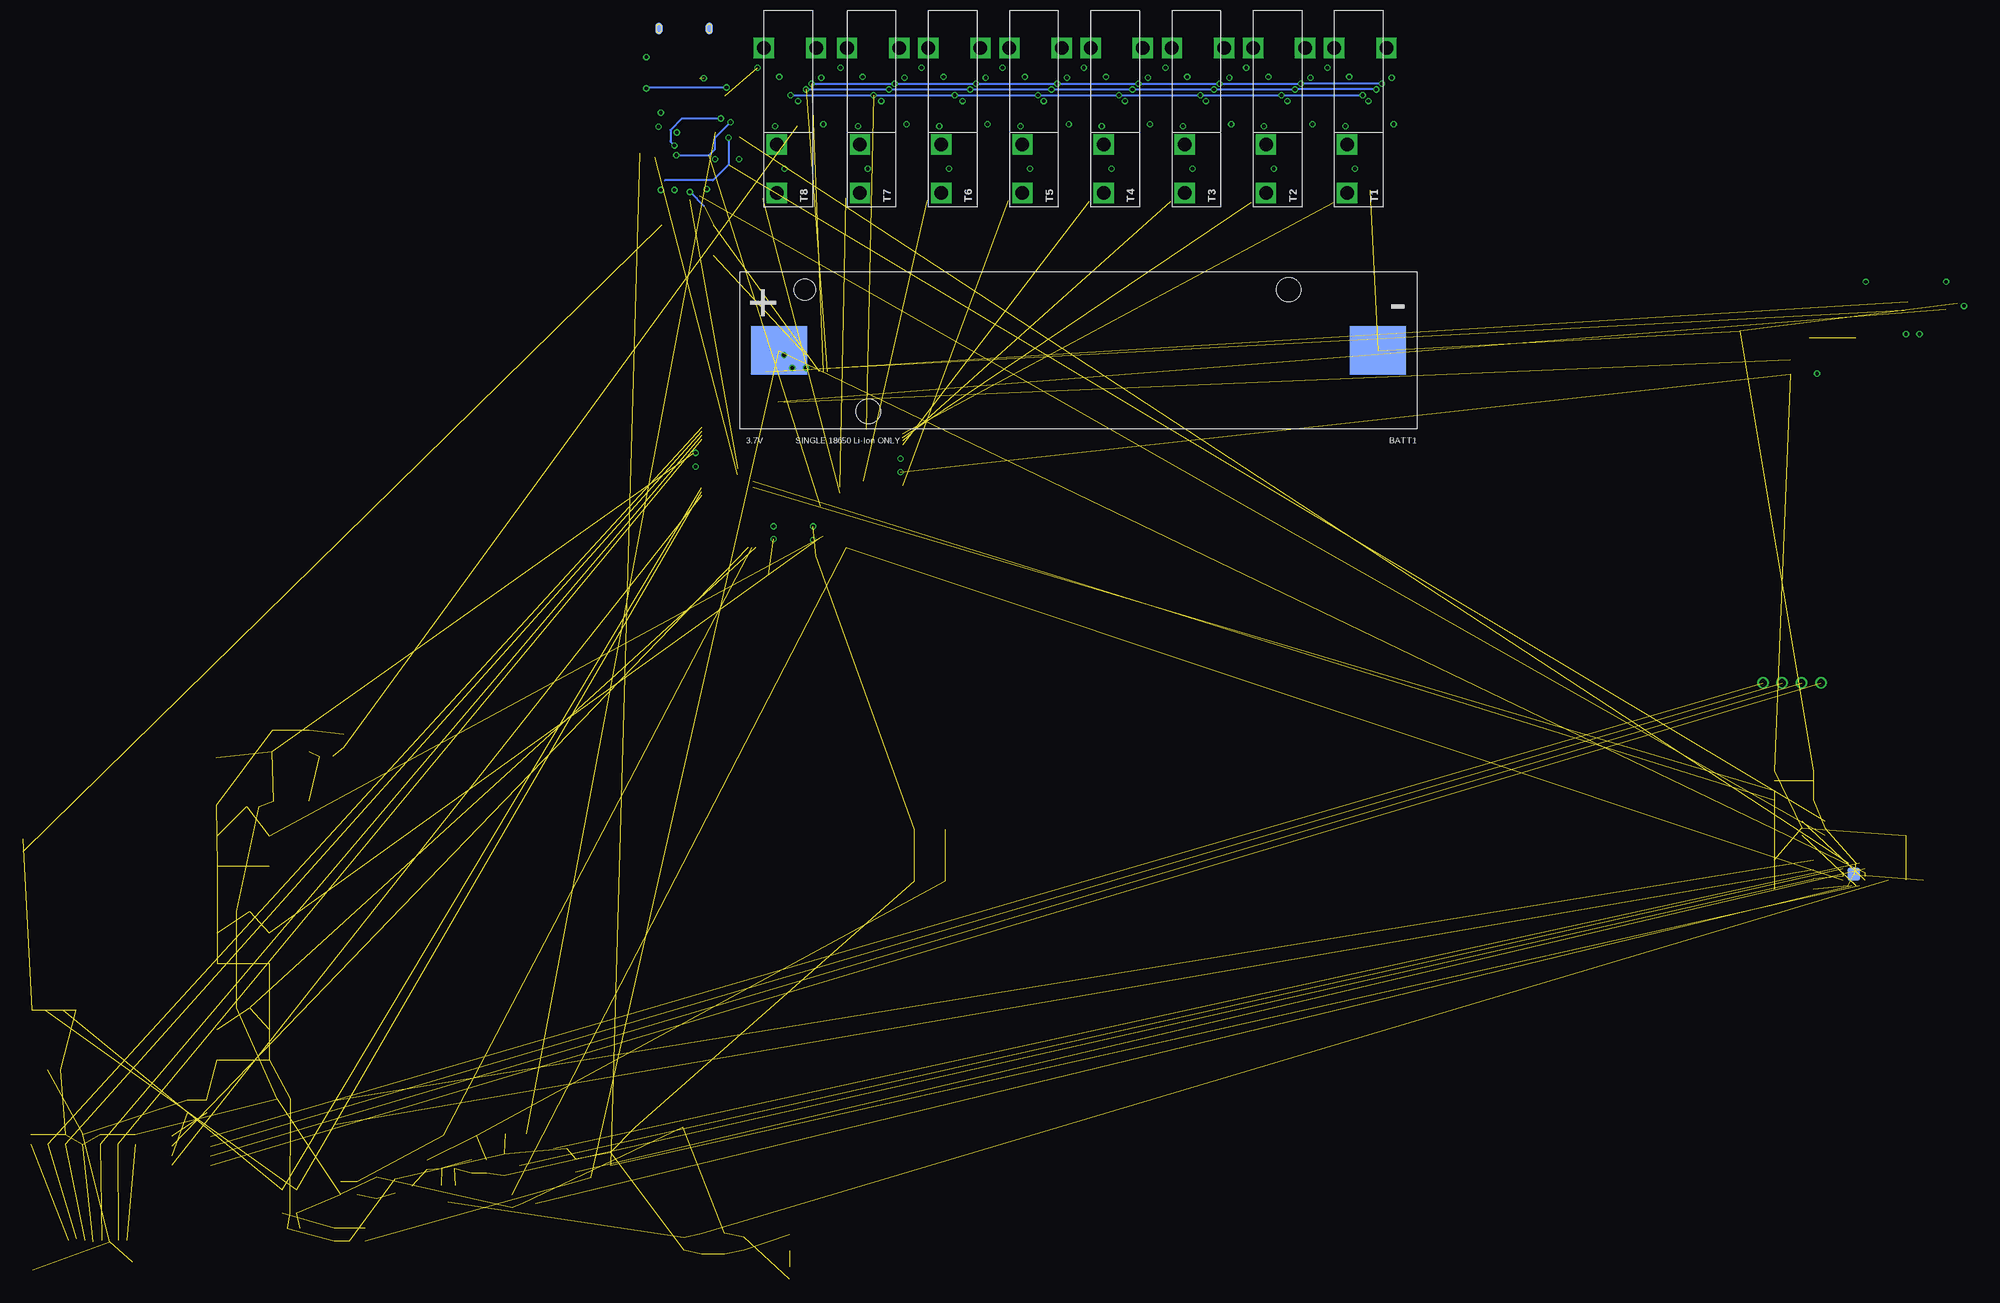
[diagram p6: board, bottom side, seen from below]

No outline drawn. Coordinates in mm, seen from the top.
Copper layers (1*2*15*16): Top 0.035mm / dielectric 0.23mm / GND 0.035mm / dielectric 0.93mm / Route15 0.035mm / dielectric 0.23mm / Bottom 0.035mm
Design rules "MF_Standard_4_Layer": minimum track width 6mil, minimum drill 12mil, track to track 6mil, track to pad 6mil, pad to pad 6mil, via to via 6mil, smd to smd 0mil, copper to edge 10mil, drill to drill 10mil, minimum pad ring 6mil, minimum via ring 6mil, stop-mask expansion 2mil, vias tented up to drill 25mil, thermal gap 10mil

### Footprints (pad centres in the part's own frame; a part is rotated, then mirrored left to right if it is on the bottom)
KEYSTONE_1042 = smd 7.341 x 6.35: N -39.332,0; P 39.332,0 | hole 3.2: -27.622,-8.001; 27.622,8.001 | hole 2.8: 35.954,-8.001
0402 = smd 0.7 x 0.9: 1 -0.65,0; 2 0.65,0
0603 = smd 1.1 x 1: 1 -0.85,0; 2 0.85,0
1206 = smd 1.6 x 1.8: 1 -1.4,0; 2 1.4,0
CASE_D = smd 2.5 x 4: N 3.15,0; P -3.15,0
LED_0805 = smd 1.2 x 1.2: ANODE 1.05,0; CATHODE -1.05,0
SOD-128 = smd 1.2 x 1.9: ANODE 2.2,0; CATHODE -2.2,0
SOT-23 = smd 1 x 1.4: 1 -0.95,-1.1; 2 0.95,-1.1; 3 0,1.1
2.54MM_01X04_PIN_HEADER = drill 1: 1 -3.81,0; 2 -1.27,0; 3 1.27,0; 4 3.81,0
MICROUSB-RIGHT = smd 0.4 x 1.35: 1 -1.3,1.27; 2 -0.65,1.27; 3 0,1.27; 4 0.65,1.27; 5 1.3,1.27 | smd 0.9 x 1.6: S1 -3.3,-1.4; S2 3.3,-1.4 | smd 1.6 x 1.4: S3 -3.2,1.27; S4 3.2,1.27 | smd 1.9 x 1.9: S5 -1.2,-1.405; S6 1.2,-1.405 | smd 0.9 x 1.6 bottom: S7 -3.3,-1.4; S8 3.3,-1.4
ER-CON31HT-1 = smd 0.28 x 1.25: P$1 -7.5,0; P$2 -7,0; P$3 -6.5,0; P$4 -6,0; P$5 -5.5,0; P$6 -5,0; P$7 -4.5,0; P$8 -4,0; P$9 -3.5,0; P$10 -3,0; P$11 -2.5,0; P$12 -2,0; P$13 -1.5,0; P$14 -1,0; P$15 -0.5,0; P$16 0,0; P$17 0.5,0; P$18 1,0; P$19 1.5,0; P$20 2,0; P$21 2.5,0; P$22 3,0; P$23 3.5,0; P$24 4,0; P$25 4.5,0; P$26 5,0; P$27 5.5,0; P$28 6,0; P$29 6.5,0; P$30 7,0; P$31 7.5,0 | smd 2 x 3: P$32 -9.04,2.325; P$33 9.04,2.325
ER-CON2.0-2P-SMD = smd 1 x 2.85: P$1 -1,0; P$2 1,0 | smd 1.4 x 3.8: P$3 3.25,6.375; P$4 -3.25,6.375
CDRH6D28 = smd 2.65 x 7.3: P$1 -2.325,0; P$2 2.325,0
ACPL-227_SO-8 = smd 2 x 0.5: 1 -2.55,1.905; 2 -2.55,0.635; 3 -2.55,-0.635; 4 -2.55,-1.905; 5 2.55,-1.905; 6 2.55,-0.635; 7 2.55,0.635; 8 2.55,1.905
MICROSDSLOT-RIGHT = smd 1.4 x 1.9: G0 -6.589,7.001; G1 6.561,6.001 | smd 0.8 x 1.5: PIN1 -1.939,3.151; PIN2 -0.839,2.951; PIN3 0.261,3.151; PIN4 1.361,3.351; PIN5 2.461,3.151; PIN6 3.561,3.351; PIN7 4.661,3.151; PIN8 5.761,3.151 | smd 1.8 x 1.4: PIN9 4.961,-7.149; PIN10 -0.739,-7.149
EVQ-Q2203W = smd 3.2 x 1: 1 -3.4,-2; 2 3.4,-2; 3 -3.4,2; 4 3.4,2
PCC-SMP-V = drill 1.778 square: M1 -20.955,3.632; M2 -20.955,-3.226; NEG -1.905,-1.524; POS -8.255,-1.524
LQFP44 = smd 1.9 x 0.4: 1 -5.7,4; 2 -5.7,3.2; 3 -5.7,2.4; 4 -5.7,1.6; 5 -5.7,0.8; 6 -5.7,0; 7 -5.7,-0.8; 8 -5.7,-1.6; 9 -5.7,-2.4; 10 -5.7,-3.2; 11 -5.7,-4; 23 5.7,-4; 24 5.7,-3.2; 25 5.7,-2.4; 26 5.7,-1.6; 27 5.7,-0.8; 28 5.7,0; 29 5.7,0.8; 30 5.7,1.6; 31 5.7,2.4; 32 5.7,3.2; 33 5.7,4 | smd 0.4 x 1.9: 12 -4,-5.7; 13 -3.2,-5.7; 14 -2.4,-5.7; 15 -1.6,-5.7; 16 -0.8,-5.7; 17 0,-5.7; 18 0.8,-5.7; 19 1.6,-5.7; 20 2.4,-5.7; 21 3.2,-5.7; 22 4,-5.7; 34 4,5.7; 35 3.2,5.7; 36 2.4,5.7; 37 1.6,5.7; 38 0.8,5.7; 39 0,5.7; 40 -0.8,5.7; 41 -1.6,5.7; 42 -2.4,5.7; 43 -3.2,5.7; 44 -4,5.7
SOIC-8 = smd 2 x 0.5: 1 -2.55,1.905; 2 -2.55,0.635; 3 -2.55,-0.635; 4 -2.55,-1.905; 5 2.55,-1.905; 6 2.55,-0.635; 7 2.55,0.635; 8 2.55,1.905
FT230X_QFN-16 = smd 0.9 x 0.35: 1 -2,0.975; 2 -2,0.325; 3 -2,-0.325; 4 -2,-0.975; 9 2,-0.975; 10 2,-0.325; 11 2,0.325; 12 2,0.975 | smd 0.35 x 0.9: 5 -0.975,-2; 6 -0.325,-2; 7 0.325,-2; 8 0.975,-2; 13 0.975,2; 14 0.325,2; 15 -0.325,2; 16 -0.975,2 | smd 2.1 x 2.1: PAD 0,0
ADP3338_SOT-223-3 = smd 1.1 x 2: 1 -2.3,-2.54; 2 0,-2.54; 3 2.3,-2.54 | smd 3.3 x 2: PAD 0,3.36
DS1340Z_SOIC-8 = smd 2 x 0.5: 1 -2.55,1.905; 2 -2.55,0.635; 3 -2.55,-0.635; 4 -2.55,-1.905; 5 2.55,-1.905; 6 2.55,-0.635; 7 2.55,0.635; 8 2.55,1.905
SOT-23-3 = smd 1 x 1.4: 1 -0.95,-1.1; 2 0.95,-1.1; 3 0,1.1
MCP3021_SOT-23-5 = smd 1.1 x 0.5: 1 -1.5,0.95; 2 -1.5,0; 3 -1.5,-0.95; 4 1.5,-0.95; 5 1.5,0.95
BQ2407X_VQFN-16 = smd 0.85 x 0.28: 1 -1.475,0.75; 2 -1.475,0.25; 3 -1.475,-0.25; 4 -1.475,-0.75; 9 1.475,-0.75; 10 1.475,-0.25; 11 1.475,0.25; 12 1.475,0.75 | smd 0.28 x 0.85: 5 -0.75,-1.475; 6 -0.25,-1.475; 7 0.25,-1.475; 8 0.75,-1.475; 13 0.75,1.475; 14 0.25,1.475; 15 -0.25,1.475; 16 -0.75,1.475 | smd 1.7 x 1.7: PAD0 0,0 | smd 1.7 x 1.7 bottom: PAD1 0,0
MAX31856_TTSOP-14 = smd 1.4 x 0.35: P$1 -2.875,1.95; P$2 -2.875,1.3; P$3 -2.875,0.65; P$4 -2.875,0; P$5 -2.875,-0.65; P$6 -2.875,-1.3; P$7 -2.875,-1.95; P$8 2.875,-1.95; P$9 2.875,-1.3; P$10 2.875,-0.65; P$11 2.875,0; P$12 2.875,0.65; P$13 2.875,1.3; P$14 2.875,1.95
IP4234CZ6_SOT-457-6 = smd 0.8 x 0.55: 1 -1.2,0.95; 2 -1.2,0; 3 -1.2,-0.95; 4 1.2,-0.95; 5 1.2,0; 6 1.2,0.95
74HCT2G04_TTSOP-6 = smd 1.2 x 0.4: 1 -1.5,0.95; 2 -1.5,0; 3 -1.5,-0.95; 4 1.5,-0.95; 5 1.5,0; 6 1.5,0.95
7MMX5MM = smd 2.2 x 1.4: P$1 -3.15,-1.27; P$2 -3.15,1.27; P$3 3.15,1.27 | smd 2.4 x 1.4: P$4 3.05,-1.27
8MM_X_3.8MM = smd 1.3 x 1.9: 1 -2.75,-1.6; 2 2.75,-1.6; 3 2.75,1.6; 4 -2.75,1.6

### Placement (x,y rotation side)
BATT1  98.81,-138.43 180 bottom
C1  229.62,-242.09 90 top
C2  145.19,-152.78 270 top
C3  137.7,-162.31 270 top
C4  125.79,-153.57 90 top
C5  135.51,-144.37 0 top
C6  233.43,-232.95 0 top
C7  148.34,-255.81 270 top
C8  145.29,-255.81 270 top
C9  150.62,-255.81 270 top
C10  142.75,-255.81 270 top
C11  146.08,-106.74 180 top
C12  150.02,-115.19 270 top
C13  143.38,-111.22 270 top
C14  155.57,-101.89 90 top
C15  59.69,-117.35 0 top
C16  56.42,-114.55 90 top
C17  59.69,-111.76 0 top
C18  61.72,-108.97 0 top
C19  64.07,-101.28 0 top
C20  67.06,-114.55 90 top
C21  70.36,-117.35 0 top
C22  70.36,-111.76 0 top
C23  199.9,-189.74 90 top
C24  72.39,-108.97 0 top
C25  204.72,-189.74 90 top
C26  74.74,-101.28 0 top
C27  195.33,-189.74 90 top
C28  77.72,-114.55 90 top
C29  81.03,-117.35 0 top
C30  81.03,-111.76 0 top
C31  162.81,-245.65 90 top
C32  174.24,-245.4 90 top
C33  172.72,-241.33 0 top
C34  181.61,-245.9 0 top
C35  184.4,-245.4 270 top
C36  191.01,-248.44 270 top
C37  203.2,-236.76 180 top
C38  201.93,-253.78 0 top
C39  196.6,-254.54 270 top
C40  153.7,-115.19 270 top
C42  135.51,-142.43 0 top
C43  123.7,-153.57 90 top
C44  147.19,-152.78 270 top
C45  153.92,-240.54 0 top
C46  83.06,-108.97 0 top
C47  85.34,-101.28 0 top
C48  88.39,-114.55 90 top
C49  91.69,-117.35 0 top
C50  91.69,-111.76 0 top
C51  93.73,-108.97 0 top
C52  96.01,-101.28 0 top
C53  212.09,-195.07 270 top
C54  -6.6,-135.38 0 top
C55  99.06,-114.55 90 top
C56  102.36,-117.35 0 top
C57  102.36,-111.76 0 top
C58  104.39,-108.97 0 top
C59  106.68,-101.28 0 top
C60  109.73,-114.55 90 top
C61  113.03,-117.35 0 top
C62  113.03,-111.76 0 top
C63  115.06,-108.97 0 top
C64  117.41,-101.28 0 top
C65  120.4,-114.55 90 top
C66  123.7,-117.35 0 top
C67  123.7,-111.76 0 top
C68  125.73,-108.97 0 top
C69  128.02,-101.28 0 top
C70  131.32,-114.55 90 top
C71  134.62,-117.35 0 top
C72  134.62,-111.76 0 top
C73  136.65,-108.97 0 top
C74  138.94,-101.28 0 top
C75  -6.6,-133.41 0 top
C76  2.79,-135.89 270 top
C77  1.27,-135.89 270 top
C78  -0.25,-135.89 270 top
C79  -1.78,-135.89 270 top
C80  -3.3,-135.89 270 top
C81  153.67,-105.19 270 top
C82  147.38,-104.33 180 top
C83  134.87,-162.31 90 top
D1  155.45,-110.01 90 top
D3  180.09,-241.59 0 top
D4  59.66,-114.55 270 top
D5  70.36,-114.55 270 top
D6  81.03,-114.55 270 top
D7  91.69,-114.55 270 top
D8  102.36,-114.55 270 top
D9  113.03,-114.55 270 top
D10  123.7,-114.55 270 top
D11  134.62,-114.55 270 top
D12  136.79,-255.65 270 top
J1  5.08,-182.12 0 top
J3  150.62,-97.54 180 top
J4  -9.65,-130.81 0 top
J6  10.92,-135.89 0 top
L1  154.05,-101.89 270 top
L2  146.81,-101.85 270 top
L18  202.18,-197.61 0 top
OP1  215.39,-243.62 180 top
R1  135.48,-139.06 0 top
R2  222.76,-242.09 90 top
R3  225.04,-242.09 90 top
R4  227.33,-242.09 90 top
R5  231.9,-242.09 90 top
R6  234.19,-242.09 90 top
R7  236.47,-242.09 90 top
R8  235.46,-225.08 0 top
R9  231.39,-225.08 180 top
R10  152.02,-105.19 270 top
R11  149.86,-105.19 270 top
R13  155.57,-106.14 270 top
R14  164.85,-245.52 90 top
R15  173.23,-250.22 90 top
R16  170.94,-250.48 180 top
R17  172.21,-244.63 90 top
R18  166.88,-243.24 180 top
R19  147.73,-115.19 270 top
R20  160.27,-244.63 270 top
R21  207.26,-198.34 180 top
R22  208.53,-212.12 0 top
R23  208.53,-224.82 0 top
R24  178.56,-245.65 270 top
R25  176.53,-245.65 270 top
R26  195.71,-248.44 270 top
R27  193.55,-248.44 270 top
R28  215.9,-237.78 270 top
R29  192.53,-254.54 90 top
R30  194.56,-254.54 270 top
R31  151.99,-115.19 90 top
R32  136.79,-259.65 90 top
R33  237.49,-203.45 270 top
R34  213.36,-237.74 270 top
R35  197.61,-191.77 0 top
R36  9.91,-139.76 90 top
R37  3.11,-140.59 270 top
R38  -11.68,-134.24 270 top
R39  -9.91,-134.24 270 top
SD1  229.62,-252.22 180 top
SW1  150.15,-123.95 180 top
SW2  208.53,-204.25 0 top
SW3  208.53,-216.95 0 top
SW4  208.53,-229.65 0 top
SW5  118.36,-204.76 90 top
T1  61.98,-119.63 270 bottom
T2  72.64,-119.63 270 bottom
T3  83.31,-119.63 270 bottom
T4  93.98,-119.63 270 bottom
T5  104.65,-119.63 270 bottom
T6  115.32,-119.63 270 bottom
T7  125.98,-119.63 270 bottom
T8  136.91,-119.63 270 bottom
U1  135.89,-153.16 270 top
U2  4.83,-195.58 0 top
U4  148.5,-110.11 180 top
U5  -9.91,-205.49 0 top
U6  4.83,-207.26 0 top
U7  187.45,-248.19 90 top
U8  181.61,-249.21 180 top
U9  202.44,-250.22 90 top
U10  -3.05,-207.26 0 top
U11  59.69,-104.14 90 top
U12  70.36,-104.14 90 top
U13  81.03,-104.14 90 top
U14  91.69,-104.14 90 top
U15  102.36,-104.14 90 top
U16  113.03,-104.14 90 top
U17  123.7,-104.14 90 top
U18  134.62,-104.14 90 top
U19  150.94,-101.79 0 top
U20  6.41,-140.59 270 top
U21  2.29,-201.17 0 top
U$1  218.69,-191.29 0 top
U$2  114.3,-254.54 0 top
U$7  236.22,-192.28 0 top
X1  136.46,-166.69 0 top
X2  193.8,-238.54 180 top

### Tracks (layer width: path | path; a pad name or v marks a point on that pad's centre or on a via)
3.3V  (via drill 0.5)  (35 unrouted)
  Top 0.254: R31.1 151.99,-117.25 v151.89,-117.35 | R19.2 147.73,-117.13 v147.64,-117.22 | J4.P$26 -4.65,-129.41 v-4.64,-129.41 | J4.P$10 -12.65,-129.55 -12.79,-129.41 -13.15,-129.41 | -13.15,-129.41 -13.65,-129.41 | -13.65,-129.41 -14.15,-129.41 | -14.15,-129.41 -14.65,-129.41 | -14.65,-129.41 v-15.18,-129.41 | J4.P$3 -16.15,-129.61 -15.96,-129.41 v-15.18,-129.41 | J4.P$9 -13.15,-129.41 | J4.P$8 -13.65,-129.41 | J4.P$7 -14.15,-129.41 | J4.P$6 -14.65,-129.41 | J4.P$4 -15.65,-129.41 v-15.18,-129.41 | R39.2 v-9.91,-136.27 | R38.2 v-11.68,-136.27 | U20.2 5.21,-141.44 R37.2 3.07,-141.48 v1.78,-141.48 | U1.40 144.76,-152.36 C2.1 146.64,-151.93 C44.1 148.59,-151.38 v149.1,-151.89 | U1.8 134.29,-144.74 C5.1 134.66,-142.43 C42.1 134.11,-141.23 v134.62,-140.72 | C83.1 133.83,-163.16 v133.67,-163.32 | U1.30 137.49,-161.25 C3.1 137.79,-161.54 v138.88,-161.54 | R1.2 v137.48,-139.06 | U1.18 126.26,-153.96 C4.1 124.25,-154.42 C43.1 123.67,-154.94 122.69,-154.94 v122.17,-154.43
  Route15 0.254: v151.89,-117.35 151.64,-117.35 | v147.64,-117.22 147.32,-117.22 | v-4.64,-129.41 -4.64,-129.03 -4.57,-129.03 | v-9.91,-136.27 -10.41,-136.27 | v-11.68,-136.27 -11.43,-136.27 | v1.78,-141.48 1.78,-141.22 | v149.1,-151.89 149.35,-151.89 | v133.67,-163.32 133.16,-163.32 | v137.48,-139.06 137.48,-139 137.41,-138.94
  pour Route15: 142.75,-95.25 157.73,-95.25 157.73,-167.89 54.61,-167.89 54.61,-126.75 142.75,-126.75
  pour Route15: -27.43,-124.71 16.51,-124.71 16.51,-146.56 -27.43,-146.56
3.3V_ANALOG  (via drill 0.5)  (2 unrouted)
  Top 0.254: U11.P$8 63.22,-101.27 C19.1 63.25,-101.31 v63.25,-102.49 | C18.1 60.34,-108.43 U11.P$5 60.34,-106.03 v60.71,-105.66 | C24.1 71.01,-108.43 U12.P$5 71.01,-106.03 v71.37,-105.66 | U12.P$8 73.87,-101.27 | 73.87,-101.27 C26.1 | C46.1 81.68,-108.43 U13.P$5 81.68,-106.03 v82.04,-105.66 | U13.P$8 82.99,-101.28 C47.1 84.49,-102.47 v84.52,-102.49 | 73.87,-101.27 73.87,-102.47 v73.85,-102.49 | C51.1 92.34,-108.43 U14.P$5 92.34,-106.03 v92.71,-105.66 | U14.P$8 93.66,-101.28 C52.1 95.19,-101.31 v95.19,-102.49 | C58.1 103.01,-108.43 U15.P$5 103.01,-106.03 v103.38,-105.66 | U15.P$8 105.81,-101.27 C59.1 105.86,-101.31 v105.86,-102.49 | v114.05,-105.66 113.68,-106.03 U16.P$5 113.68,-108.43 C63.1 | U16.P$8 115,-101.28 C64.1 116.52,-101.32 v116.52,-102.49 | v124.71,-105.66 124.35,-106.03 U17.P$5 124.35,-108.43 C68.1 | U17.P$8 127.15,-101.27 C69.1 127.17,-102.47 v127.19,-102.49 | v135.64,-105.66 135.27,-106.03 U18.P$5 135.27,-108.43 C73.1 | U18.P$8 136.59,-101.28 C74.1 138.09,-102.47 v138.11,-102.49
  Route15 0.254: v60.71,-105.66 61.21,-105.66 | v71.37,-105.66 71.63,-105.66 | v82.04,-105.66 82.3,-105.66 | v92.71,-105.66 92.96,-105.66 | v103.38,-105.66 103.12,-105.66 | v114.05,-105.66 114.3,-105.41 | v124.71,-105.66 124.71,-105.41 | v135.64,-105.66 135.64,-105.41
  pour Route15: 54.61,-95.25 141.99,-95.25 141.99,-125.98 54.61,-125.98
3V3OUT  (via drill 0.5)
  Top 0.254: U4.8 147.52,-107.33 C11.1 146.93,-107.43 146.41,-107.95 v145.8,-107.95 | U4.1 151.47,-111.08 v151.89,-111.51
  Bottom 0.254: v145.8,-107.95 150.88,-107.95 152.4,-109.47 152.4,-111 v151.89,-111.51
!PWREN  (1 unrouted)
  Top 0.254: U4.14 148.17,-112.94 147.73,-113.38 R19.1 148.38,-114.34 148.59,-114.55 148.59,-118.11 149.61,-119.13 153.16,-119.13
!SLEEP  (via drill 0.5)  (1 unrouted)
  Top 0.254: U4.11 144.84,-110.43 v144.78,-110.49
  Bottom 0.254: v144.78,-110.49 144.78,-114.05 146.81,-116.08 153.16,-116.08
A
  Top 0.254: J6.P$1 9.91,-135.91 R36.2
A_0  (3 unrouted)
ADC_0_!CS  (1 unrouted)
  Top 0.254: U11.P$9 60.99,-103.41 65.41,-107.82 65.41,-119 | U1.13 127.1,-149.96 126.49,-149.35 121.92,-149.35
ADC_1_!CS  (1 unrouted)
  Top 0.254: U12.P$9 71.66,-103.41 76.07,-107.82 76.07,-118.94 | U1.14 127.14,-150.76 126.24,-149.86 121.92,-149.86
ADC_2_!CS  (1 unrouted)
  Top 0.254: U13.P$9 82.33,-103.41 86.74,-107.82 86.74,-118.87 | U1.15 127.18,-151.56 125.98,-150.37 121.92,-150.37
ADC_3_!CS  (1 unrouted)
  Top 0.254: U14.P$9 92.99,-103.41 97.41,-107.82 97.41,-118.87 | U1.16 127.22,-152.36 125.73,-150.88 121.92,-150.88
ADC_4_!CS  (1 unrouted)
  Top 0.254: U15.P$9 103.66,-103.41 108.08,-107.82 108.08,-118.75 | U1.19 127.18,-154.76 125.73,-156.21 121.92,-156.21
ADC_5_!CS  (1 unrouted)
  Top 0.254: U16.P$9 114.33,-103.15 118.68,-107.5 118.68,-118.68 | U1.20 127.14,-155.56 125.98,-156.72 121.92,-156.72
ADC_6_!CS  (1 unrouted)
  Top 0.254: U17.P$9 125,-103.15 129.41,-107.57 129.41,-118.43 | U1.21 127.1,-156.36 126.24,-157.23 121.92,-157.23
ADC_7_!CS  (1 unrouted)
  Top 0.254: U18.P$9 135.92,-103.15 140.34,-107.57 140.34,-118.49 | U1.22 127.06,-157.16 126.49,-157.73 121.92,-157.73
ADC_SCK  (via drill 0.5)  (1 unrouted)
  Top 0.254: U11.P$10 60.34,-103.77 v61.47,-104.9 | U12.P$10 71.01,-103.77 v72.14,-104.9 | U13.P$10 81.68,-103.77 v82.8,-104.9 | U14.P$10 92.34,-103.77 v93.47,-104.9 | U15.P$10 103.01,-103.77 v104.14,-104.9 | U16.P$10 113.68,-103.52 v115.06,-104.9 | U17.P$10 124.35,-103.52 v125.73,-104.9 | U18.P$10 135.27,-103.52 v136.65,-104.9 | U1.12 127.06,-149.16 126.75,-148.84 121.92,-148.84
  Bottom 0.254: v61.47,-104.9 v72.14,-104.9 v82.8,-104.9 v93.47,-104.9 v104.14,-104.9 v115.06,-104.9 v125.73,-104.9 v136.65,-104.9
ADC_SDI  (via drill 0.5)  (1 unrouted)
  Top 0.254: U11.P$12 59.04,-103.27 v58.93,-103.38 | v69.6,-103.38 69.71,-103.27 U12.P$12 | U13.P$12 80.38,-103.27 v80.26,-103.38 | U14.P$12 91.04,-103.27 v90.93,-103.38 | U15.P$12 101.71,-103.27 v101.6,-103.38 | U16.P$12 112.38,-103.27 v112.27,-103.38 | U17.P$12 123.05,-103.27 v122.94,-103.38 | U18.P$12 133.97,-103.27 v133.86,-103.38 | U1.10 132.69,-145.14 132.33,-144.78 132.33,-141.22
  Bottom 0.254: v58.93,-103.38 v69.6,-103.38 v80.26,-103.38 v90.93,-103.38 v101.6,-103.38 v112.27,-103.38 v122.94,-103.38 v133.86,-103.38
ADC_SDO  (via drill 0.5)  (1 unrouted)
  Top 0.254: U11.P$11 v59.69,-104.14 | v70.36,-104.14 U12.P$11 | U13.P$11 v81.03,-104.14 | U14.P$11 v91.69,-104.14 | U15.P$11 v102.36,-104.14 | U16.P$11 v113.03,-104.14 | U17.P$11 v123.7,-104.14 | U18.P$11 v134.62,-104.14 | U1.11 131.89,-145.1 131.83,-145.03 131.83,-141.22
  Bottom 0.254: v59.69,-104.14 v70.36,-104.14 v81.03,-104.14 v91.69,-104.14 v102.36,-104.14 v113.03,-104.14 v123.7,-104.14 v134.62,-104.14
BCD_CHARGER  (2 unrouted)
  Top 0.254: U4.5 151.8,-108.11 154.18,-110.49 154.18,-112.01 154.69,-112.52 156.46,-112.52
CHARGING  (2 unrouted)
  Top 0.254: U1.23 131.89,-159.96 131.32,-160.53 131.32,-162.31 129.29,-164.34
D+
  Top 0.254: U19.3 149.74,-104.22 R11.1 C82.1
D-
  Top 0.254: U19.4 152.14,-104.22 | 152.14,-104.22 R10.1 | 152.14,-104.22 152.26,-104.34 C81.1
EXT0  (1 unrouted)
  Top 0.254: U1.34 143.7,-157.16 144.02,-157.48 148.34,-157.48
EXT1  (1 unrouted)
  Top 0.254: U1.33 139.89,-159.96 142.24,-162.31 142.24,-164.34
EXT_CON_0  (1 unrouted)
EXT_CON_1  (1 unrouted)
EXT_CON_2  (1 unrouted)
EXT_CON_3  (1 unrouted)
FT230_RST  (via drill 0.5)  (1 unrouted)
  Top 0.254: v144.53,-108.46 145.2,-109.13 U4.9 | v151.64,-112.78 151.99,-113.13 R31.2 C40.1 | U1.24 132.69,-159.92 131.83,-160.78 131.83,-162.56 130.05,-164.34
  Bottom 0.254: v151.64,-112.78 147.32,-112.78 146.56,-112.01 146.56,-110.49 v144.53,-108.46
GND  (via drill 0.5)  (57 unrouted)
  Top 0.254: C17.2 60.76,-111.98 D4.3 | C15.2 60.76,-117.13 D4.3 | C19.2 v66.1,-101.28 | C18.2 v63.75,-108.97 | D4.3 v62.48,-114.55 | U11.P$1 57.74,-108.38 v57.4,-108.71 | U11.P$14 57.74,-102.53 v57.66,-102.62 | D5.3 v73.15,-114.55 | D5.3 71.46,-117.35 C21.2 | D5.3 71.46,-111.76 C22.2 | C24.2 v74.42,-108.97 | U12.P$1 68.41,-108.38 v68.07,-108.71 | C26.2 v76.77,-101.28 | U12.P$14 68.41,-102.53 v68.33,-102.62 | D6.3 v83.82,-114.55 | C30.2 82.13,-111.76 D6.3 | C47.2 v87.38,-101.28 | D6.3 82.13,-117.1 C29.2 | C46.2 v85.09,-108.97 | U13.P$1 79.08,-108.38 v78.74,-108.71 | U13.P$14 79.08,-102.53 v78.99,-102.62 | C49.2 92.79,-117.35 D7.3 | C50.2 92.79,-111.76 D7.3 | C52.2 v98.11,-101.28 | C51.2 v95.76,-108.97 | D7.3 v94.49,-114.55 | U14.P$1 89.74,-108.38 v89.41,-108.71 | U14.P$14 89.74,-102.53 v89.66,-102.62 | D8.3 v105.16,-114.55 | C56.2 103.46,-117.1 D8.3 | C58.2 v106.43,-108.97 | C57.2 103.46,-112.01 D8.3 | U15.P$1 100.41,-108.38 v100.08,-108.71 | U15.P$14 100.41,-102.53 v100.33,-102.62 | C59.2 v108.78,-101.28 | D9.3 v115.82,-114.55 | C62.2 114.13,-112.01 D9.3 | C61.2 114.13,-117.1 D9.3 | U16.P$1 111.08,-108.38 v110.74,-108.71 | C63.2 v117.09,-108.97 | C64.2 v119.44,-101.28 | U16.P$14 111.08,-102.53 v111,-102.62 | D10.3 v126.49,-114.55 | C66.2 124.8,-117.1 D10.3 | C67.2 124.8,-112.01 D10.3 | U17.P$1 121.75,-108.38 v121.41,-108.71 | U17.P$14 121.75,-102.53 v121.67,-102.62 | C68.2 v127.76,-108.97 | C69.2 v130.05,-101.28 | U18.P$14 132.67,-102.53 v132.59,-102.62 | U18.P$1 132.67,-108.38 v132.33,-108.71 | D11.3 v137.41,-114.55 | C71.2 135.72,-117.1 D11.3 | C72.2 135.72,-112.01 D11.3 | C73.2 v138.68,-108.97 | C74.2 v140.97,-101.28 | J3.5 149.32,-99.85 148.59,-100.58 148.59,-101.79
  Top 0.254: 148.59,-101.79 U19.2 | L2.2 148.59,-102.7 148.59,-101.79 | C81.2 v153.67,-107.19 | C14.2 v155.57,-99.89 | C13.2 v143.38,-113.28 | L2.2 146.53,-102.98 | U4.PAD 148.82,-109.78 U4.3 v151.57,-109.78 v151.57,-109.79 | U4.13 147.52,-112.83 147.07,-113.28 v146.56,-113.28 | J4.P$2 -16.65,-132.31 -16.93,-132.59 -17.15,-132.59 | -17.15,-132.59 v-17.53,-132.59 | J4.P$1 -17.15,-132.59 | U1.39 144.72,-153.16 C2.2 146.64,-153.63 C44.2 148.59,-154.18 v149.1,-153.67 | U1.5 136.69,-145.54 | 136.69,-145.54 136.69,-144.7 C5.2 136.36,-142.43 C42.2 136.91,-141.23 v136.4,-140.72 | U1.6 135.89,-145.9 136.25,-145.54 136.69,-145.54 | U1.27 135.09,-161.24 C83.2 134.79,-161.54 v133.67,-161.54 | C3.2 138.84,-163.16 v138.88,-163.19 | U1.17 126.23,-153.16 C4.2 124.25,-152.72 C43.2 123.67,-152.14 122.69,-152.14 v122.17,-152.65 | L2.2 146.81,-104.33 C82.2 145.86,-104.33 145.23,-104.96 C11.2 | C40.2 153.7,-117.32 v153.67,-117.35 | D1.CATHODE 155.45,-110.24 155.19,-109.98 154.69,-109.98 153.99,-109.28 v153.99,-109.03
  GND 0.254: v63.75,-108.97 64.01,-108.71 | v57.4,-108.71 56.9,-108.71 | v57.66,-102.62 57.15,-102.62 | v74.42,-108.97 74.42,-108.46 | v68.07,-108.71 67.82,-108.71 | v76.77,-101.28 76.71,-101.09 | v68.33,-102.62 67.82,-102.62 | v83.82,-114.55 84.07,-114.05 | v87.38,-101.28 87.38,-100.84 | v85.09,-108.97 85.09,-108.71 | v78.74,-108.71 78.23,-108.71 | v78.99,-102.62 78.74,-102.62 | v98.11,-101.28 97.92,-100.97 97.79,-100.84 | v95.76,-108.97 95.76,-108.71 | v89.41,-108.71 88.9,-108.71 | v89.66,-102.62 88.9,-102.62 | v105.16,-114.55 105.16,-114.3 | v106.43,-108.97 106.43,-108.71 | v100.08,-108.71 99.31,-108.71 | v100.33,-102.62 100.08,-102.62 | v108.78,-101.28 108.65,-100.9 108.71,-100.84 | v115.82,-114.55 115.82,-114.3 | v110.74,-108.71 110.24,-108.46 | v117.09,-108.97 117.09,-108.71 | v119.44,-101.28 119.44,-101.16 119.38,-101.09 | v111,-102.62 110.74,-102.62 | v126.49,-114.55 126.49,-114.3 | v121.41,-108.71 120.9,-108.71 | v121.67,-102.62 121.41,-102.62 | v127.76,-108.97 127.76,-108.71 | v130.05,-101.28 130.05,-100.84 | v132.59,-102.62 132.33,-102.62 | v132.33,-108.71 131.83,-108.71 | v137.41,-114.55 137.41,-114.3 | v138.68,-108.97 138.68,-108.46 | v140.97,-101.28 140.91,-100.9 140.97,-100.84 | v153.67,-107.19 153.92,-107.19 | v155.57,-99.89 155.45,-99.82 155.45,-99.57 | v143.38,-113.28 143.38,-113.54 143.51,-113.54 | v146.56,-113.28 146.56,-113.79 | v-17.53,-132.59 -18.29,-132.59 | v149.1,-153.67 149.1,-153.16 | v153.67,-117.35 153.42,-117.35
  other vias: 148.02,-102.68
  pour GND: 54.61,-95.25 141.99,-95.25 141.99,-125.98 54.61,-125.98
  pour GND: 142.75,-95.25 157.73,-95.25 157.73,-167.89 54.61,-167.89 54.61,-126.75 142.75,-126.75
  pour GND: -27.43,-124.71 16.51,-124.71 16.51,-146.56 -27.43,-146.56
ILM  (1 unrouted)
IRQ  (1 unrouted)
ISET  (1 unrouted)
LCD_BKLT  (1 unrouted)
  Top 0.254: U20.1 5.21,-139.74 R37.1 | U1.4 137.49,-145.21 138.18,-144.53 138.18,-141.22
LCD_RST  (1 unrouted)
  Top 0.254: J4.P$5 -15.15,-133.01 -15.75,-133.6 | U1.3 138.29,-145.17 138.68,-144.78 138.68,-141.22
LCD_SCL  (1 unrouted)
  Top 0.254: J4.P$16 -9.65,-133.13 R39.1 | U1.1 139.89,-141.22
LCD_SDA  (1 unrouted)
  Top 0.254: J4.P$11 -12.15,-132.06 -11.82,-132.4 -11.68,-132.4 | -11.65,-132.4 -11.15,-132.4 | -11.15,-132.4 J4.P$13 | J4.P$12 -11.65,-132.4 | J4.P$15 -10.15,-132.03 -10.52,-132.4 -11.15,-132.4 | R38.1 -11.68,-132.4 | -11.68,-132.4 -11.65,-132.4 | U1.2 139.09,-145.14 139.19,-145.03 139.19,-141.22
N$2
  Top 0.254: J4.P$20 -7.65,-132.33 | -7.65,-132.33 -7.65,-133.41 | -7.65,-133.41 C75.1 | J4.P$17 -9.15,-132.07 -8.89,-132.33 -8.65,-132.33 | -8.65,-132.33 -8.15,-132.33 | -8.15,-132.33 -7.65,-132.33 | J4.P$18 -8.65,-132.33 | J4.P$19 -8.15,-132.33 | -7.65,-133.41 -7.65,-135.38 C54.1
N$3
  Top 0.254: 155.65,-109.16 D1.ANODE 155.57,-108.84 R13.2
N$4  (4 unrouted)
N$5  (2 unrouted)
N$6  (1 unrouted)
N$7
  Top 0.254: R36.1 9.88,-140.59 U20.3
N$8
  Top 0.254: J4.P$24 -5.65,-132.33 | -5.65,-132.33 -5.65,-133.41 | -5.65,-133.41 C75.2 | J4.P$23 -6.15,-132.33 | -6.15,-132.33 -5.65,-132.33 | J4.P$22 -6.65,-132.33 | -6.65,-132.33 -6.15,-132.33 | J4.P$21 -7.15,-132.04 -6.86,-132.33 -6.65,-132.33 | -5.65,-133.41 -5.65,-135.38 C54.2
N$9
  Top 0.254: C80.1 -3.3,-133.86 -5.15,-132.01 J4.P$25
N$10
  Top 0.254: J4.P$27 -4.15,-132.36 -3.16,-133.35 -2.54,-133.35 -1.78,-134.11 C79.1
N$11
  Top 0.254: J4.P$28 -3.65,-132.19 -3,-132.84 -1.52,-132.84 -0.25,-134.11 C78.1
N$12
  Top 0.254: J4.P$29 -3.15,-131.9 -2.71,-132.33 -0.51,-132.33 1.27,-134.11 C77.1
N$13
  Top 0.254: J4.P$30 -2.65,-131.78 -2.54,-131.89 0.57,-131.89 2.79,-134.11 C76.1
N$14  (4 unrouted)
N$22  (1 unrouted)
N$23
  Top 0.254: J3.2 151.27,-99.97 U19.6
N$24  (1 unrouted)
N$25  (2 unrouted)
N$26
  Top 0.254: J3.3 150.62,-99.96 U19.1
N$27
  Top 0.254: L2.1 146.81,-99.42 J3.S4 147.32,-98.81 J3.S2 J3.S6 J3.S5 J3.S1 153.92,-98.81 J3.S3
PGOOD  (1 unrouted)
PWR_SW  (3 unrouted)
  Top 0.254: U1.32 139.09,-160.17 139.19,-160.27 139.45,-160.27 141.73,-162.56 141.73,-164.34
PWREN  (1 unrouted)
RES  (1 unrouted)
  Top 0.254: SW1.4 SW1.3 | U1.7 135.09,-145.77 135.51,-145.35 135.51,-139.95 R1.1
RTC_X1  (1 unrouted)
RTC_X2  (1 unrouted)
RTS
  Top 0.254: U4.16 149.47,-112.89 150.11,-113.54 150.11,-114.24 C12.1
RX  (1 unrouted)
  Top 0.254: U4.2 151.84,-110.43 154.43,-113.03 156.46,-113.03 | U1.37 143.59,-154.76 144.78,-155.96 148.34,-155.96
S_P_G  (4 unrouted)
SCL  (4 unrouted)
  Top 0.254: U1.35 143.66,-156.36 144.27,-156.97 148.34,-156.97
SD_CS  (2 unrouted)
  Top 0.254: U1.44 143.45,-149.16 144.02,-148.59 148.34,-148.59
SD_DI  (2 unrouted)
  Top 0.254: U1.43 143.41,-149.96 144.27,-149.1 148.34,-149.1
SD_DO  (2 unrouted)
  Top 0.254: U1.41 143.33,-151.56 144.78,-150.11 148.34,-150.11
SD_RW  (1 unrouted)
SD_SCLK  (2 unrouted)
  Top 0.254: U1.42 143.37,-150.76 144.53,-149.61 148.34,-149.61
SDA  (4 unrouted)
  Top 0.254: U1.36 143.62,-155.56 144.53,-156.46 148.34,-156.46
SLEEP  (1 unrouted)
SW_DWN  (3 unrouted)
  Top 0.254: U1.31 138.29,-160.39 138.68,-160.78 139.19,-160.78 141.22,-162.81 141.22,-164.34
SW_SEL  (3 unrouted)
  Top 0.254: U1.26 134.29,-160.35 133.86,-160.78 133.35,-160.78 132.84,-161.29 132.84,-163.07 131.57,-164.34
SW_UP  (3 unrouted)
  Top 0.254: U1.25 133.49,-159.88 132.33,-161.04 132.33,-162.81 130.81,-164.34
SYS_V  (7 unrouted)
SYS_V_SW  (3 unrouted)
TP_T+_0
  Top 0.254: T1.POS 62.36,-110.24 59.69,-110.24 58.84,-111.09 C17.1 58.84,-113.32 D4.1 58.46,-113.7 C16.2 56.42,-112.24 59.69,-108.97 U11.P$4
TP_T+_1
  Top 0.254: T2.POS 73.03,-110.24 70.36,-110.24 69.51,-111.09 C22.1 69.51,-113.6 D5.1 69.26,-113.7 C20.2 67.06,-112.27 70.36,-108.97 U12.P$4
TP_T+_2
  Top 0.254: T3.POS 83.69,-110.24 81.03,-110.24 80.18,-111.09 C30.1 80.18,-113.6 D6.1 79.83,-113.7 C28.2 77.72,-112.27 81.03,-108.97 U13.P$4
TP_T+_3
  Top 0.254: T4.POS 94.36,-110.24 91.69,-110.24 90.84,-111.09 C50.1 90.84,-113.6 D7.1 arc-90 90.49,-113.7 C48.2 88.39,-112.27 91.69,-108.97 U14.P$4
TP_T+_4
  Top 0.254: T5.POS 105.03,-110.24 102.36,-110.24 101.51,-111.09 C57.1 101.51,-113.35 D8.1 101.16,-113.7 C55.2 99.06,-112.27 102.36,-108.97 U15.P$4
TP_T+_5
  Top 0.254: T6.POS 115.7,-110.24 113.03,-110.24 112.18,-111.09 C62.1 112.18,-113.35 D9.1 111.83,-113.7 C60.2 109.73,-112.27 113.03,-108.97 U16.P$4
TP_T+_6
  Top 0.254: T7.POS 126.36,-110.24 123.7,-110.24 122.85,-111.09 C67.1 122.85,-113.35 D10.1 122.5,-113.7 C65.2 120.4,-112.27 123.7,-108.97 U17.P$4
TP_T+_7
  Top 0.254: T8.POS 137.29,-110.24 134.62,-110.24 133.77,-111.09 C72.1 133.77,-113.6 D11.1 133.42,-113.7 C70.2 131.32,-112.27 134.62,-108.97 U18.P$4
TP_T-_0
  Top 0.254: T1.NEG 62.36,-118.87 59.69,-118.87 58.84,-118.02 C15.1 58.84,-115.79 D4.2 58.46,-115.4 C16.1 55.71,-115.4 55.37,-115.06 55.37,-112.01 58.42,-108.97 | 58.42,-108.97 58.42,-107.81 U11.P$2 | U11.P$3 59.04,-108.69 58.76,-108.97 58.42,-108.97
TP_T-_1
  Top 0.254: T2.NEG 73.03,-118.87 70.36,-118.87 69.51,-118.02 C21.1 69.51,-115.5 D5.2 69.26,-115.4 C20.1 66.13,-115.4 65.94,-115.22 65.94,-112.11 69.06,-109 | U12.P$2 69.06,-109 | U12.P$3 69.71,-108.69 69.4,-109 69.06,-109
TP_T-_2
  Top 0.254: T3.NEG 83.69,-118.87 81.03,-118.87 80.18,-118.02 C29.1 80.18,-115.75 D6.2 79.83,-115.4 C28.1 76.97,-115.4 76.59,-115.02 76.59,-112.14 79.73,-109 | U13.P$2 79.73,-109 | U13.P$3 80.38,-108.69 80.07,-109 79.73,-109
TP_T-_3
  Top 0.254: T4.NEG 94.36,-118.87 91.69,-118.87 90.84,-118.02 C49.1 90.84,-115.5 D7.2 arc90 90.49,-115.4 C48.1 87.64,-115.4 87.38,-115.14 87.38,-112.01 90.39,-109 | U14.P$2 90.39,-109 | U14.P$3 91.04,-108.69 90.74,-109 90.39,-109
TP_T-_4
  Top 0.254: T5.NEG 105.03,-118.87 102.36,-118.87 101.51,-118.02 C56.1 101.51,-115.75 D8.2 101.16,-115.4 C55.1 98.39,-115.4 98.04,-115.06 98.04,-112.01 101.06,-109 | U15.P$2 101.06,-109 | U15.P$3 101.71,-108.69 101.41,-109 101.06,-109
TP_T-_5
  Top 0.254: T6.NEG 115.7,-118.87 113.03,-118.87 112.18,-118.02 C61.1 112.18,-115.75 D9.2 111.83,-115.4 C60.1 109.05,-115.4 108.71,-115.06 108.71,-112.01 111.73,-109 | U16.P$2 111.73,-109 | U16.P$3 112.38,-108.69 112.08,-109 111.73,-109
TP_T-_6
  Top 0.254: T7.NEG 126.36,-118.87 123.7,-118.87 122.85,-118.02 C66.1 122.85,-115.75 D10.2 122.5,-115.4 C65.1 119.72,-115.4 119.38,-115.06 119.38,-112.01 122.4,-109 | U17.P$2 122.4,-109 | U17.P$3 123.05,-108.63 122.68,-109 122.4,-109
TP_T-_7
  Top 0.254: T8.NEG 137.29,-118.87 134.62,-118.87 133.77,-118.02 C71.1 133.77,-115.75 D11.2 133.42,-115.4 C70.1 130.64,-115.4 130.3,-115.06 130.3,-112.01 133.32,-109 | U18.P$2 133.32,-109 | U18.P$3 133.97,-108.69 133.66,-109 133.32,-109
TS  (1 unrouted)
TX  (1 unrouted)
  Top 0.254: U4.15 148.82,-113.51 149.1,-113.79 149.1,-117.86 149.86,-118.62 153.16,-118.62 | U1.38 143.55,-153.96 145.03,-155.45 148.34,-155.45
TXRX_LED
  Top 0.254: U4.12 145.46,-111.08 145.29,-111.25
USB_RST  (via drill 0.5)  (3 unrouted)
  Top 0.254: C12.2 150.02,-117.44 v149.86,-117.6 | SW1.2 SW1.1 | U1.9 133.49,-145.17 132.84,-144.53 132.84,-141.22
  Bottom 0.254: 148.02,-119.45 v149.86,-117.6
USB_V0
  Top 0.254: J3.1 151.92,-99.6 152.4,-100.08 152.91,-100.08 153.16,-100.33 153.16,-101.09 | 153.16,-101.09 153.16,-101.79 U19.5 | L1.1 154.05,-101.09 153.16,-101.09
USB_V1  (via drill 0.5)  (2 unrouted)
  Top 0.254: L1.2 C14.1 v155.57,-104.01 R13.1 | U4.10 144.58,-109.78 143.89,-109.09 | 143.89,-109.09 143.51,-108.71 143.51,-105.41 v145.03,-103.89 | C13.1 143.38,-109.6 143.89,-109.09
  Bottom 0.254: v145.03,-103.89 155.45,-103.89 v155.57,-104.01
USBDM
  Top 0.254: R10.2 151.38,-106.04 150.53,-105.19 149.16,-105.19 148.65,-105.66 148.17,-106.15 U4.7
USBDP
  Top 0.254: R11.2 149.13,-106.04 148.82,-106.35 U4.6
VBATT  (4 unrouted)
X0
  Top 0.254: U1.29 136.69,-163.78 arc90 138.33,-165.42 X1.P$3
X1
  Top 0.254: U1.28 135.89,-166.65 arc-90 134.58,-167.96 X1.P$1